# Altium project Gesturelink Backplane.PrjPcb
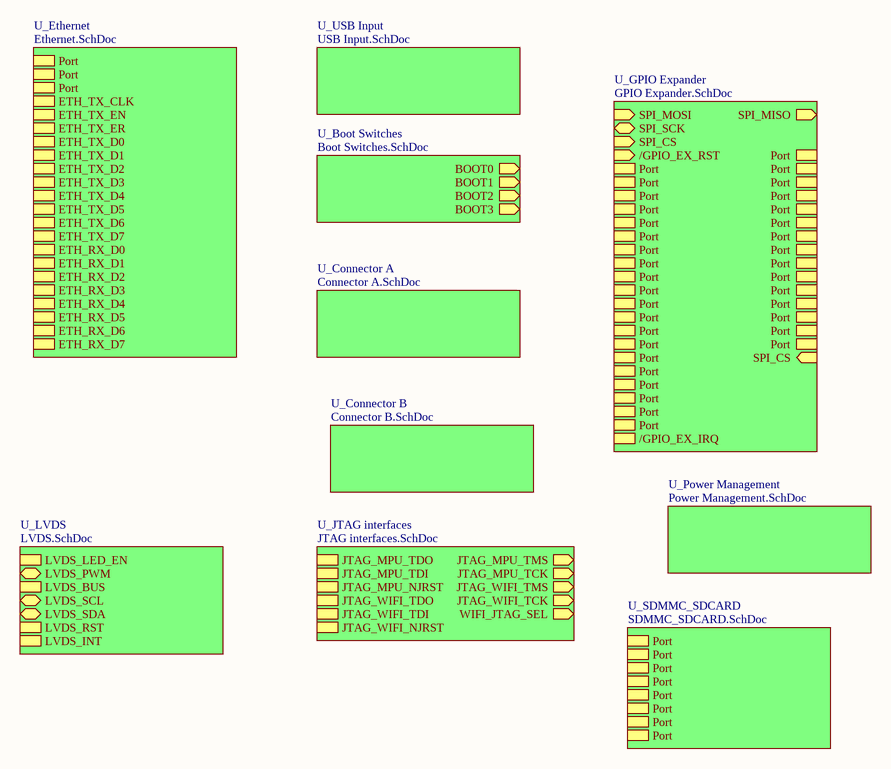
[diagram p0: Main.SchDoc]
13 sheets, 226 parts. Net scope: hierarchical (ports join the sheet entries above them; power ports are global).
Board file: Backplane.PcbDoc
Sheets:
  Main.SchDoc
    U_USB Input = USB Input.SchDoc
    U_Boot Switches = Boot Switches.SchDoc
    U_Connector A = Connector A.SchDoc
    U_Connector B = Connector B.SchDoc
    U_Ethernet = Ethernet.SchDoc
    U_GPIO Expander = GPIO Expander.SchDoc
    U_JTAG interfaces = JTAG interfaces.SchDoc
    U_LVDS = LVDS.SchDoc
    U_Power Management = Power Management.SchDoc
    U_SDMMC_SDCARD = SDMMC_SDCARD.SchDoc
  PCIe.SchDoc
  Notes.SchDoc

## Sheet Main.SchDoc
size A4; SheetNumber: 1; SheetTotal: 12

### Sub-sheets
U_Boot Switches = Boot Switches.SchDoc: BOOT0 (out), BOOT1 (out), BOOT2 (out), BOOT3 (out)
U_Connector A = Connector A.SchDoc: no entries
U_Connector B = Connector B.SchDoc: no entries
U_Ethernet = Ethernet.SchDoc: Port, Port, Port, ETH_TX_CLK, ETH_TX_EN, ETH_TX_ER, ETH_TX_D0, ETH_TX_D1, ETH_TX_D2, ETH_TX_D3, ETH_TX_D4, ETH_TX_D5, ETH_TX_D6, ETH_TX_D7, ETH_RX_D0, ETH_RX_D1, ETH_RX_D2, ETH_RX_D3, ETH_RX_D4, ETH_RX_D5, ETH_RX_D6, ETH_RX_D7
U_GPIO Expander = GPIO Expander.SchDoc: SPI_MOSI (in), SPI_MISO (out), SPI_SCK (bidir), SPI_CS (in), /GPIO_EX_RST (in), Port, Port, Port, Port, Port, Port, Port, Port, Port, Port, Port, Port, Port, Port, Port, Port, Port, Port, Port, Port, /GPIO_EX_IRQ, Port, Port, Port, Port, Port, Port, Port, Port, Port, Port, Port, Port, Port, Port, Port, SPI_CS (in)
U_JTAG interfaces = JTAG interfaces.SchDoc: JTAG_MPU_TMS (out), JTAG_MPU_TCK (out), JTAG_MPU_TDO, JTAG_MPU_TDI, JTAG_MPU_NJRST, JTAG_WIFI_TMS (out), JTAG_WIFI_TCK (out), JTAG_WIFI_TDO, JTAG_WIFI_TDI, JTAG_WIFI_NJRST, WIFI_JTAG_SEL (out)
U_LVDS = LVDS.SchDoc: LVDS_LED_EN, LVDS_PWM (bidir), LVDS_BUS (harness LVDS_CONNECTOR), LVDS_SCL (bidir), LVDS_SDA (bidir), LVDS_RST, LVDS_INT
U_Power Management = Power Management.SchDoc: no entries
U_SDMMC_SDCARD = SDMMC_SDCARD.SchDoc: Port, Port, Port, Port, Port, Port, Port, Port
U_USB Input = USB Input.SchDoc: no entries

### Nets
NetR?#17_2: sheet U_Ethernet/Port, sheet U_Ethernet/Port, sheet U_Ethernet/Port
NetR?#44_2: sheet U_GPIO Expander/Port, sheet U_GPIO Expander/Port, sheet U_GPIO Expander/Port, sheet U_GPIO Expander/Port, sheet U_GPIO Expander/Port, sheet U_GPIO Expander/Port, sheet U_GPIO Expander/Port, sheet U_GPIO Expander/Port, sheet U_GPIO Expander/Port, sheet U_GPIO Expander/Port, sheet U_GPIO Expander/Port, sheet U_GPIO Expander/Port, sheet U_GPIO Expander/Port, sheet U_GPIO Expander/Port, sheet U_GPIO Expander/Port, sheet U_GPIO Expander/Port, sheet U_GPIO Expander/Port, sheet U_GPIO Expander/Port, sheet U_GPIO Expander/Port, sheet U_GPIO Expander/Port, sheet U_GPIO Expander/Port, sheet U_GPIO Expander/Port, sheet U_GPIO Expander/Port, sheet U_GPIO Expander/Port, sheet U_GPIO Expander/Port, sheet U_GPIO Expander/Port, sheet U_GPIO Expander/Port, sheet U_GPIO Expander/Port, sheet U_GPIO Expander/Port, sheet U_GPIO Expander/Port, sheet U_GPIO Expander/Port, sheet U_GPIO Expander/Port, sheet U_GPIO Expander/Port, sheet U_GPIO Expander/Port, sheet U_GPIO Expander/Port
NetR?#52_1: sheet U_GPIO Expander/SPI_CS, sheet U_GPIO Expander/SPI_CS
NetR?#131_1: sheet U_SDMMC_SDCARD/Port, sheet U_SDMMC_SDCARD/Port, sheet U_SDMMC_SDCARD/Port, sheet U_SDMMC_SDCARD/Port, sheet U_SDMMC_SDCARD/Port, sheet U_SDMMC_SDCARD/Port, sheet U_SDMMC_SDCARD/Port, sheet U_SDMMC_SDCARD/Port

## Sheet USB Input.SchDoc
size A4; SheetNumber: 4; SheetTotal: 13
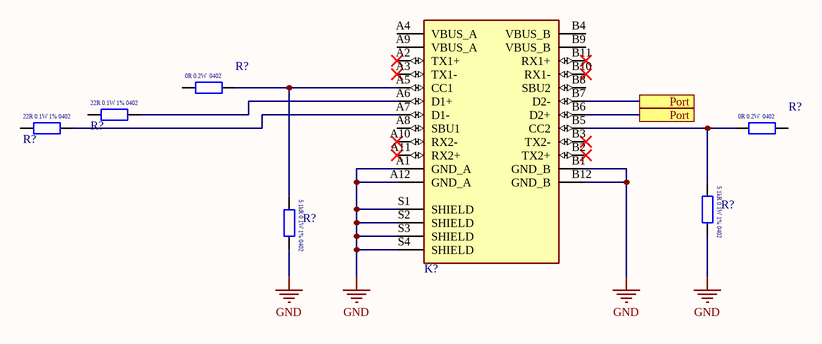
[diagram p1: USB Input.SchDoc]

### Parts
(Parts that share a designator on the sheet are numbered #1, #2 ... from top to bottom, then left to right.)
K?#1  2171830001  [217183-0001]  (value not drawn)
R?#1  CRCW04020000Z0EDHP  [RESC1005X04L]  (value not drawn)
R?#2  RK73H1ETTP22R0F  [RESC1005X04N]  (value not drawn)
R?#3  RK73H1ETTP22R0F  [RESC1005X04N]  (value not drawn)
R?#4  CRCW04020000Z0EDHP  [RESC1005X04L]  (value not drawn)
R?#5  RK73H1ETTP5101F  [RESC1005X04N]  (value not drawn)
R?#6  RK73H1ETTP5101F  [RESC1005X04N]  (value not drawn)

### Ports
Port

### Nets
GND: K?#1.A1(GND_A) K?#1.A12(GND_A) K?#1.B1(GND_B) K?#1.B12(GND_B) K?#1.S1(SHIELD) K?#1.S2(SHIELD) K?#1.S3(SHIELD) K?#1.S4(SHIELD) R?#5.2 R?#6.2
NetK?#1_A5: K?#1.A5(CC1) R?#1.2 R?#6.1
NetK?#1_A6: K?#1.A6(D1+) R?#2.2
NetK?#1_A7: K?#1.A7(D1-) R?#3.2
NetK?#1_B5: K?#1.B5(CC2) R?#4.1 R?#5.1
NetK?#1_B6: K?#1.B6(D2+) K?#1.B7(D2-) ; port Port

Not connected (* = marked no-connect by the designer): K?#1 A2(TX1+)* A3(TX1-)* A4(VBUS_A) A8(SBU1) A9(VBUS_A) A10(RX2-)* A11(RX2+)* B2(TX2+)* B3(TX2-)* B4(VBUS_B) B8(SBU2) B9(VBUS_B) B10(RX1-)* B11(RX1+)*; R?#1 1; R?#2 1; R?#3 1; R?#4 2

### Notes on the sheet
- (in symbol CRCW04020000Z0EDHP) 0R 0.2W  0402
- (in symbol RK73H1ETTP22R0F) 22R 0.1W 1% 0402
- (in symbol RK73H1ETTP5101F) 5.1kR 0.1W 1% 0402

### Library data of the parts
K?#1 = 2171830001: USB-C (USB TYPE-C) USB 3.2 Gen 1 (USB 3.1 Gen 1, Superspeed (USB 3.0)) Receptacle Connector 24 Position Through Hole, Right Angle
R?#1 R?#4 = CRCW04020000Z0EDHP: 0 Ohms Jumper Chip Resistor 0402 (1005 Metric) Automotive AEC-Q200, Pulse Withstanding Thick Film; ComponentLink1Description: New link; ComponentLink1URL: https://www.digikey.com.au/en/products/detail/vishay-dale/CRCW04020000Z0EDHP/2222496; Supplier 1: Mouser; Supplier Part Number 1: 71-CRCW04020000Z0EDH
R?#2 R?#3 = RK73H1ETTP22R0F: 22 Ohms ±1% 0.1W, 1/10W Chip Resistor 0402 (1005 Metric) Automotive AEC-Q200 Thick Film
R?#5 R?#6 = RK73H1ETTP5101F: 5.1 kOhms ±1% 0.1W, 1/10W Chip Resistor 0402 (1005 Metric) Automotive AEC-Q200 Thick Film

## Sheet Boot Switches.SchDoc
size A4; SheetNumber: 9; SheetTotal: 10
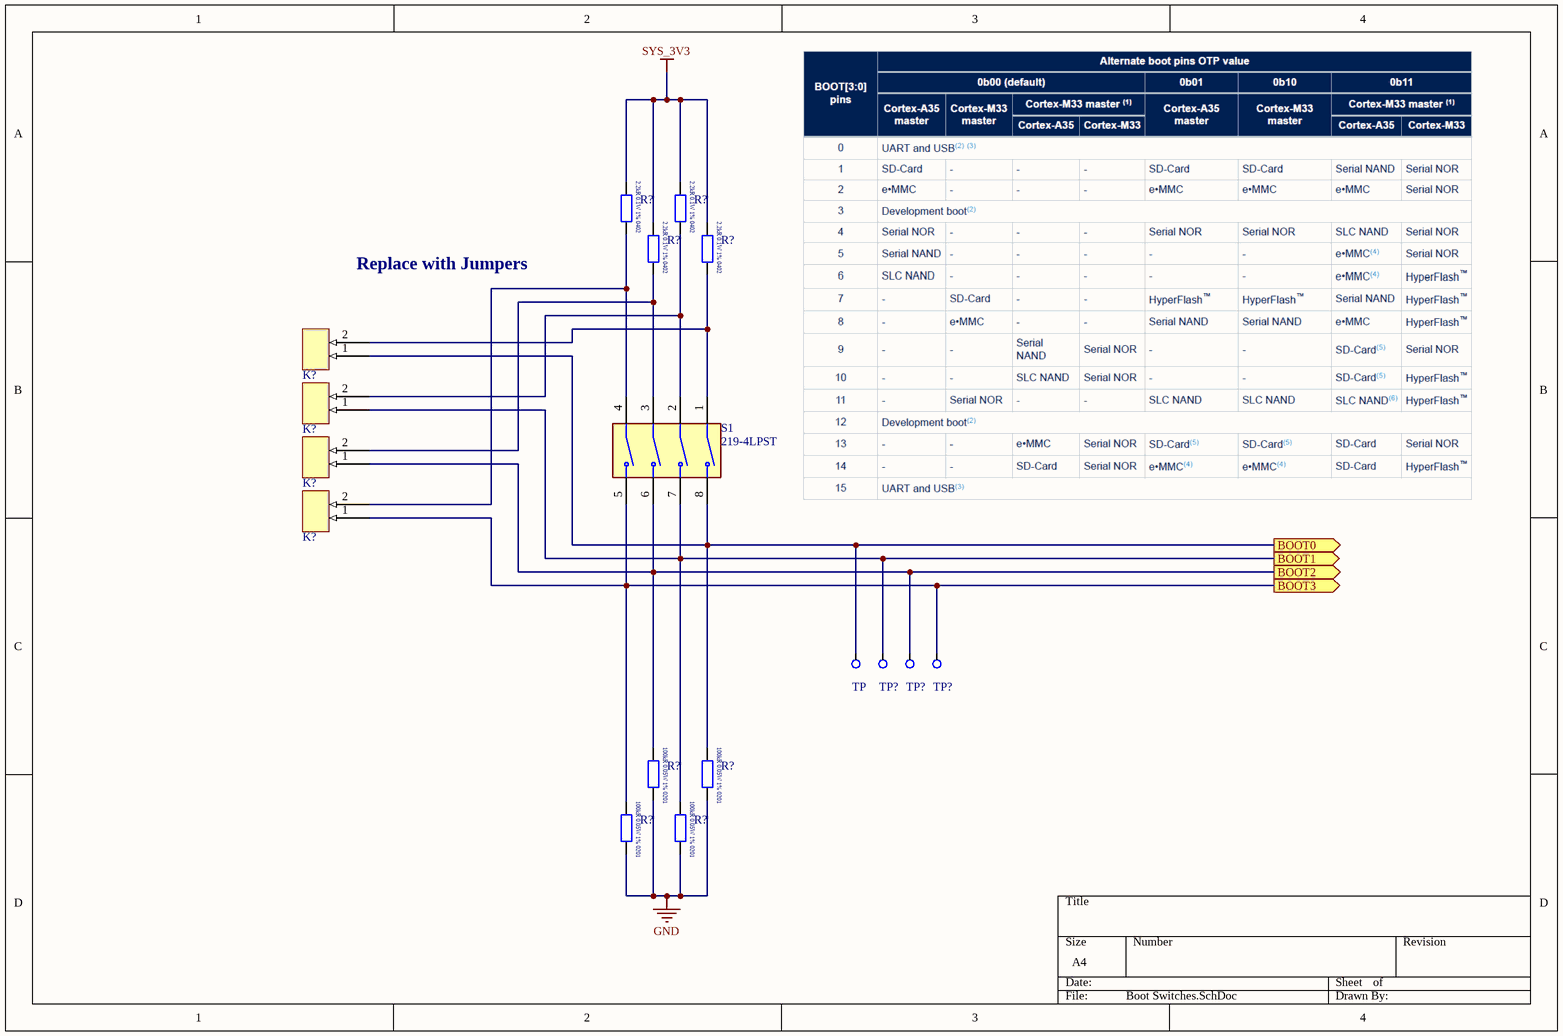
[diagram p2: Boot Switches.SchDoc]

### Parts
(Parts that share a designator on the sheet are numbered #1, #2 ... from top to bottom, then left to right.)
K?#2  TSW-102-07-F-S  [SAMTEC_TSW-102-07-F-S]  (value not drawn)
K?#3  TSW-102-07-F-S  [SAMTEC_TSW-102-07-F-S]  (value not drawn)
K?#4  TSW-102-07-F-S  [SAMTEC_TSW-102-07-F-S]  (value not drawn)
K?#5  TSW-102-07-F-S  [SAMTEC_TSW-102-07-F-S]  (value not drawn)
R?#7  ERJ-2RKF2201X  [RESC1005X04N]  (value not drawn)
R?#8  ERJ-2RKF2201X  [RESC1005X04N]  (value not drawn)
R?#9  ERJ-2RKF2201X  [RESC1005X04N]  (value not drawn)
R?#10  ERJ-2RKF2201X  [RESC1005X04N]  (value not drawn)
R?#11  RK73H1ETTP1003F  [RESC1005X04N]  (value not drawn)
R?#12  RK73H1ETTP1003F  [RESC1005X04N]  (value not drawn)
R?#13  RK73H1ETTP1003F  [RESC1005X04N]  (value not drawn)
R?#14  RK73H1ETTP1003F  [RESC1005X04N]  (value not drawn)
S1  219-4LPST  [SW_219-4LPST]
TP#1  Test Point  [Test Point]  (value not drawn)
TP?#1  Test Point  [Test Point]  (value not drawn)
TP?#2  Test Point  [Test Point]  (value not drawn)
TP?#3  Test Point  [Test Point]  (value not drawn)

### Ports
BOOT0 (out), BOOT1 (out), BOOT2 (out), BOOT3 (out)

### Nets
GND: R?#11.2 R?#12.2 R?#13.2 R?#14.2
SYS_3V3: R?#7.1 R?#8.1 R?#9.1 R?#10.1
NetK?#2_1: K?#2.1 R?#12.1 S1.8 TP#1.12 ; port BOOT0
NetK?#2_2: K?#2.2 R?#10.2 S1.1
NetK?#3_1: K?#3.1 R?#14.1 S1.7 TP?#1.12 ; port BOOT1
NetK?#3_2: K?#3.2 R?#8.2 S1.2
NetK?#4_1: K?#4.1 R?#11.1 S1.6 TP?#2.12 ; port BOOT2
NetK?#4_2: K?#4.2 R?#9.2 S1.3
NetK?#5_1: K?#5.1 R?#13.1 S1.5 TP?#3.12 ; port BOOT3
NetK?#5_2: K?#5.2 R?#7.2 S1.4

### Notes on the sheet
- Replace with Jumpers
- (in symbol ERJ-2RKF2201X) 2.2kR 0.1W 1% 0402
- (in symbol RK73H1ETTP1003F) 100kR 0.05W 1% 0201

### Library data of the parts
K?#2-K?#5 = TSW-102-07-F-S: Connector Header Through Hole 2 position 0.100" (2.54mm)
R?#7-R?#10 = ERJ-2RKF2201X: RES SMD 2.2K OHM 1% 1/10W 0402
R?#11-R?#14 = RK73H1ETTP1003F: 100 kOhms ±1% 0.1W, 1/10W Chip Resistor 0402 (1005 Metric) Automotive AEC-Q200 Thick Film
S1 = 219-4LPST: Dip Switch SPST 4 Position Surface Mount Slide (Standard) Actuator 100mA 20VDC; MF: {'manufacturer': u'CTS Electrocomponents'}; Package: None; Price: None; Value: *; MP: 219-4LPST; Availability: Unavailable

## Sheet Connector A.SchDoc
size A4; SheetNumber: 2; SheetTotal: 11
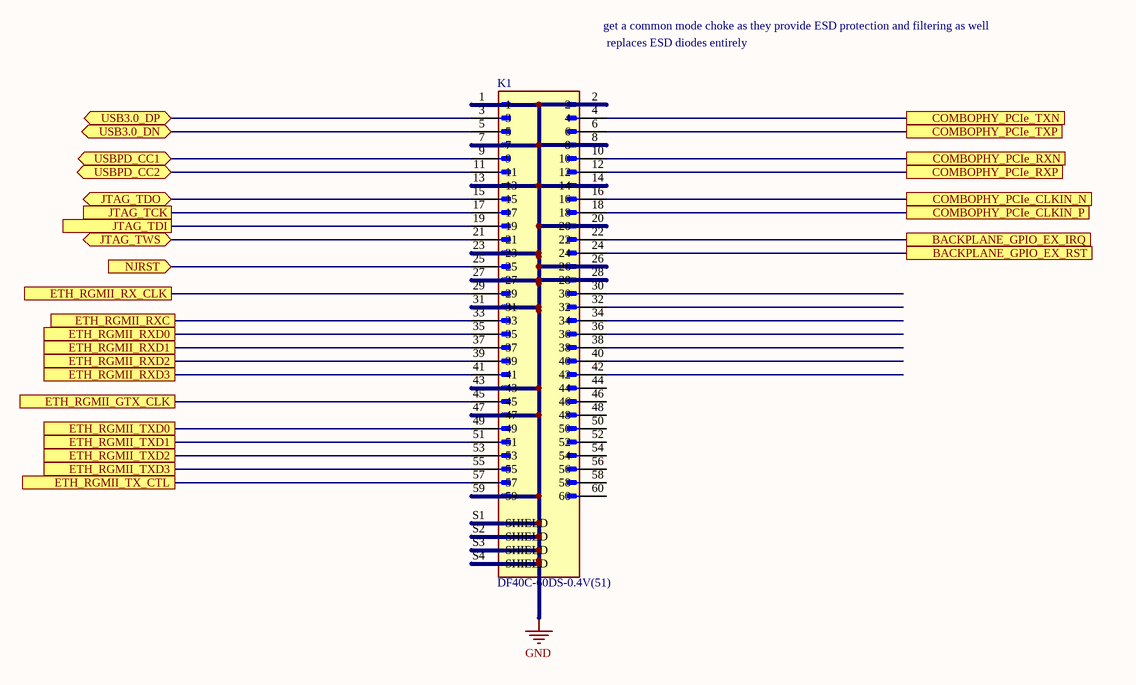
[diagram p3: Connector A.SchDoc]

### Parts
K1  DF40C-60DS-0.4V(51)  [DF40C-60DS-0.4V(51)]

### Ports
BACKPLANE_GPIO_EX_IRQ, BACKPLANE_GPIO_EX_RST, COMBOPHY_PCIe_CLKIN_N, COMBOPHY_PCIe_CLKIN_P, COMBOPHY_PCIe_RXN, COMBOPHY_PCIe_RXP, COMBOPHY_PCIe_TXN, COMBOPHY_PCIe_TXP, ETH_RGMII_GTX_CLK, ETH_RGMII_RX_CLK, ETH_RGMII_RXC, ETH_RGMII_RXD0, ETH_RGMII_RXD1, ETH_RGMII_RXD2, ETH_RGMII_RXD3, ETH_RGMII_TX_CTL, ETH_RGMII_TXD0, ETH_RGMII_TXD1, ETH_RGMII_TXD2, ETH_RGMII_TXD3, JTAG_TCK, JTAG_TDI, JTAG_TDO (bidir), JTAG_TWS (bidir), NJRST (in), USB3.0_DN (bidir), USB3.0_DP (bidir), USBPD_CC1 (bidir), USBPD_CC2 (bidir)

### Nets
GND: K1.1 K1.2 K1.7 K1.8 K1.13 K1.14 K1.20 K1.23 K1.26 K1.27 K1.28 K1.31 K1.43 K1.47 K1.59 K1.S1(SHIELD) K1.S2(SHIELD) K1.S3(SHIELD) K1.S4(SHIELD)
NetK1_3: K1.3 ; port USB3.0_DP
NetK1_4: K1.4 ; port COMBOPHY_PCIe_TXN
NetK1_5: K1.5 ; port USB3.0_DN
NetK1_6: K1.6 ; port COMBOPHY_PCIe_TXP
NetK1_9: K1.9 ; port USBPD_CC1
NetK1_10: K1.10 ; port COMBOPHY_PCIe_RXN
NetK1_11: K1.11 ; port USBPD_CC2
NetK1_12: K1.12 ; port COMBOPHY_PCIe_RXP
NetK1_15: K1.15 ; port JTAG_TDO
NetK1_16: K1.16 ; port COMBOPHY_PCIe_CLKIN_N
NetK1_17: K1.17 ; port JTAG_TCK
NetK1_18: K1.18 ; port COMBOPHY_PCIe_CLKIN_P
NetK1_19: K1.19 ; port JTAG_TDI
NetK1_21: K1.21 ; port JTAG_TWS
NetK1_22: K1.22 ; port BACKPLANE_GPIO_EX_IRQ
NetK1_24: K1.24 ; port BACKPLANE_GPIO_EX_RST
NetK1_25: K1.25 ; port NJRST
NetK1_29: K1.29 ; port ETH_RGMII_RX_CLK
NetK1_33: K1.33 ; port ETH_RGMII_RXC
NetK1_35: K1.35 ; port ETH_RGMII_RXD0
NetK1_37: K1.37 ; port ETH_RGMII_RXD1
NetK1_39: K1.39 ; port ETH_RGMII_RXD2
NetK1_41: K1.41 ; port ETH_RGMII_RXD3
NetK1_45: K1.45 ; port ETH_RGMII_GTX_CLK
NetK1_49: K1.49 ; port ETH_RGMII_TXD0
NetK1_51: K1.51 ; port ETH_RGMII_TXD1
NetK1_53: K1.53 ; port ETH_RGMII_TXD2
NetK1_55: K1.55 ; port ETH_RGMII_TXD3
NetK1_57: K1.57 ; port ETH_RGMII_TX_CTL

Not connected (* = marked no-connect by the designer): K1 30 32 34 36 38 40 42 44 46 48 50 52 54 56 58 60

### Notes on the sheet
- get a common mode choke as they provide ESD protection and filtering as well
- replaces ESD diodes entirely

### Library data of the parts
K1 = DF40C-60DS-0.4V(51): 60 Position Connector Receptacle, Center Strip Contacts Surface Mount Gold

## Sheet Connector B.SchDoc
size A4; SheetNumber: 2; SheetTotal: 9
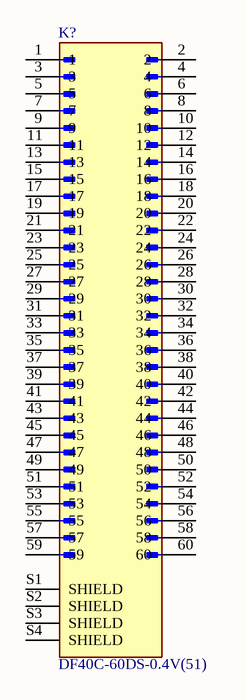
[diagram p4: Connector B.SchDoc]

### Parts
(Parts that share a designator on the sheet are numbered #1, #2 ... from top to bottom, then left to right.)
K?#6  DF40C-60DS-0.4V(51)  [DF40C-60DS-0.4V(51)]

### Nets

Not connected (* = marked no-connect by the designer): K?#6 1 2 3 4 5 6 7 8 9 10 11 12 13 14 15 16 17 18 19 20 21 22 23 24 25 26 27 28 29 30 31 32 33 34 35 36 37 38 39 40 41 42 43 44 45 46 47 48 49 50 51 52 53 54 55 56 57 58 59 60 S1(SHIELD) S2(SHIELD) S3(SHIELD) S4(SHIELD)

### Library data of the parts
K?#6 = DF40C-60DS-0.4V(51): 60 Position Connector Receptacle, Center Strip Contacts Surface Mount Gold /

## Sheet Ethernet.SchDoc
size A4; SheetNumber: 7; SheetTotal: 11
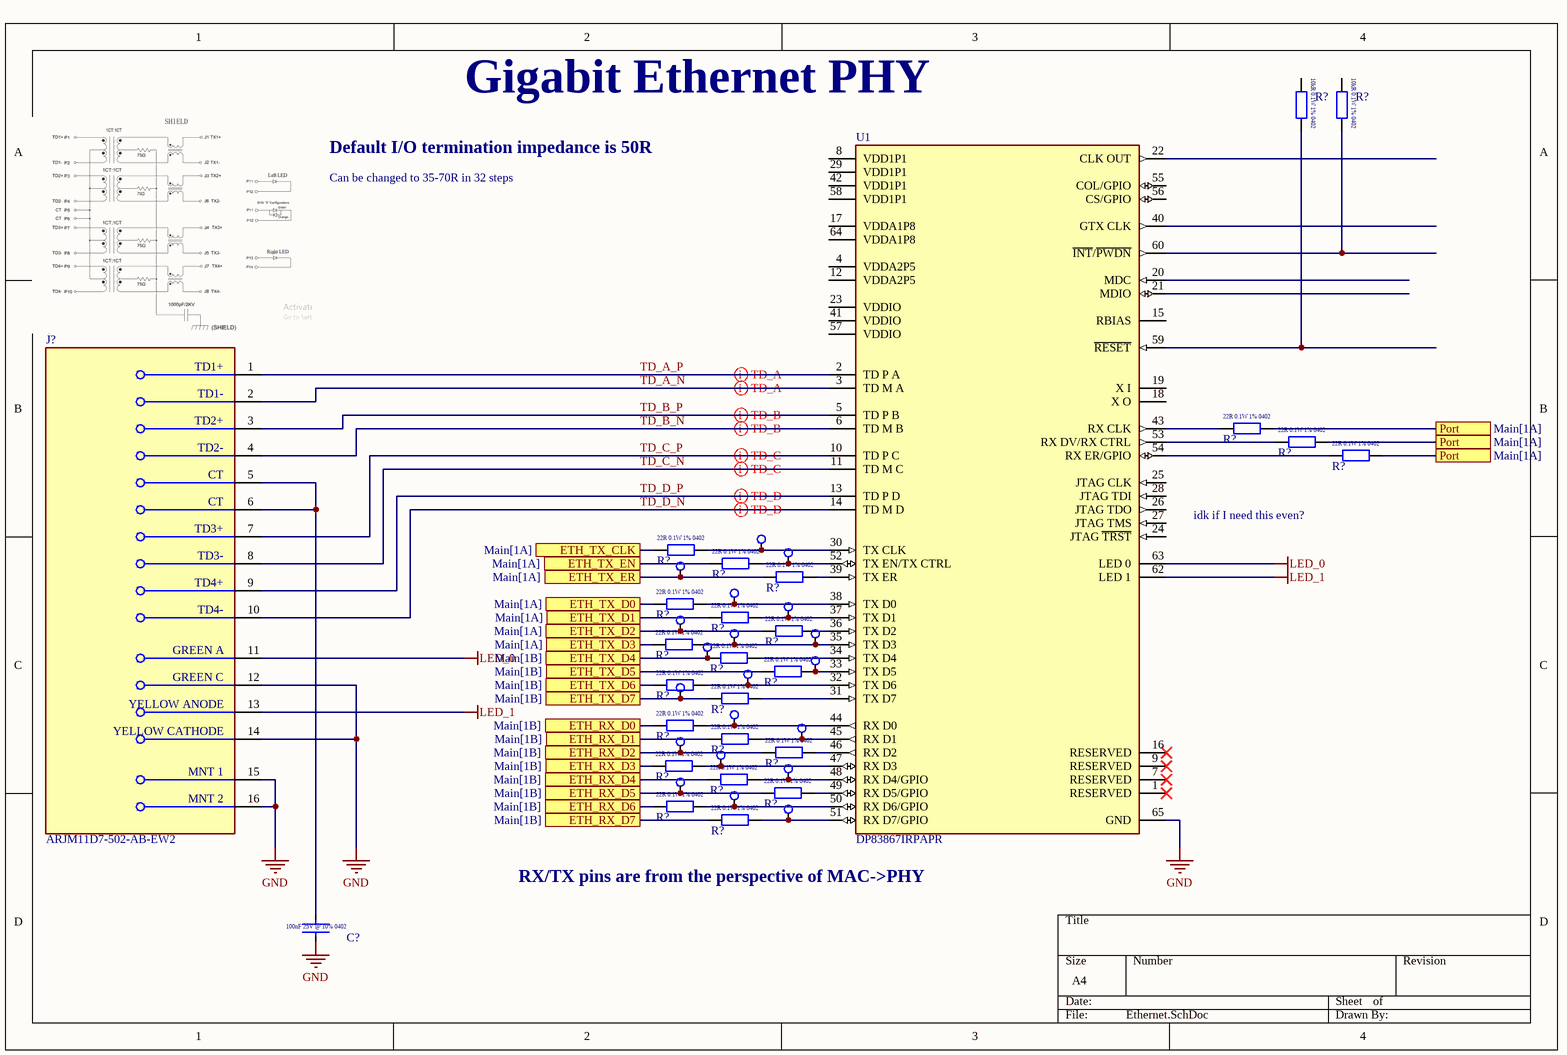
[diagram p5: Ethernet.SchDoc]

### Parts
(Parts that share a designator on the sheet are numbered #1, #2 ... from top to bottom, then left to right.)
C?#1  CL05A104KA5NNNC  [CAPC1005X06N]  (value not drawn)
J?#1  ARJM11D7-502-AB-EW2  [FP-ARJM11D7-502-AB-EW2-MFG]
R?#15  RK73H1ETTP1002F  [RESC1005X04N]  (value not drawn)
R?#16  RK73H1ETTP1002F  [RESC1005X04N]  (value not drawn)
R?#17  RK73H1ETTP22R0F  [RESC1005X04N]  (value not drawn)
R?#18  RK73H1ETTP22R0F  [RESC1005X04N]  (value not drawn)
R?#19  RK73H1ETTP22R0F  [RESC1005X04N]  (value not drawn)
R?#20  RK73H1ETTP22R0F  [RESC1005X04N]  (value not drawn)
R?#21  RK73H1ETTP22R0F  [RESC1005X04N]  (value not drawn)
R?#22  RK73H1ETTP22R0F  [RESC1005X04N]  (value not drawn)
R?#23  RK73H1ETTP22R0F  [RESC1005X04N]  (value not drawn)
R?#24  RK73H1ETTP22R0F  [RESC1005X04N]  (value not drawn)
R?#25  RK73H1ETTP22R0F  [RESC1005X04N]  (value not drawn)
R?#26  RK73H1ETTP22R0F  [RESC1005X04N]  (value not drawn)
R?#27  RK73H1ETTP22R0F  [RESC1005X04N]  (value not drawn)
R?#28  RK73H1ETTP22R0F  [RESC1005X04N]  (value not drawn)
R?#29  RK73H1ETTP22R0F  [RESC1005X04N]  (value not drawn)
R?#30  RK73H1ETTP22R0F  [RESC1005X04N]  (value not drawn)
R?#31  RK73H1ETTP22R0F  [RESC1005X04N]  (value not drawn)
R?#32  RK73H1ETTP22R0F  [RESC1005X04N]  (value not drawn)
R?#33  RK73H1ETTP22R0F  [RESC1005X04N]  (value not drawn)
R?#34  RK73H1ETTP22R0F  [RESC1005X04N]  (value not drawn)
R?#35  RK73H1ETTP22R0F  [RESC1005X04N]  (value not drawn)
R?#36  RK73H1ETTP22R0F  [RESC1005X04N]  (value not drawn)
R?#37  RK73H1ETTP22R0F  [RESC1005X04N]  (value not drawn)
R?#38  RK73H1ETTP22R0F  [RESC1005X04N]  (value not drawn)
TP1  Test Point  [Test Point]  (value not drawn)
TP2  Test Point  [Test Point]  (value not drawn)
TP3  Test Point  [Test Point]  (value not drawn)
TP4  Test Point  [Test Point]  (value not drawn)
TP5#1  Test Point  [Test Point]  (value not drawn)
TP5#2  Test Point  [Test Point]  (value not drawn)
TP7  Test Point  [Test Point]  (value not drawn)
TP8  Test Point  [Test Point]  (value not drawn)
TP9  Test Point  [Test Point]  (value not drawn)
TP10  Test Point  [Test Point]  (value not drawn)
TP11  Test Point  [Test Point]  (value not drawn)
TP?#4  Test Point  [Test Point]  (value not drawn)
TP?#5  Test Point  [Test Point]  (value not drawn)
TP?#6  Test Point  [Test Point]  (value not drawn)
TP?#7  Test Point  [Test Point]  (value not drawn)
TP?#8  Test Point  [Test Point]  (value not drawn)
TP?#9  Test Point  [Test Point]  (value not drawn)
TP?#10  Test Point  [Test Point]  (value not drawn)
TP?#11  Test Point  [Test Point]  (value not drawn)
TP?#12  Test Point  [Test Point]  (value not drawn)
U1  DP83867IRPAPR  [FP-PAP0064M-MFG]

### Ports
ETH_RX_D0 (see Main[1B]), ETH_RX_D1 (see Main[1B]), ETH_RX_D2 (see Main[1B]), ETH_RX_D3 (see Main[1B]), ETH_RX_D4 (see Main[1B]), ETH_RX_D5 (see Main[1B]), ETH_RX_D6 (see Main[1B]), ETH_RX_D7 (see Main[1B]), ETH_TX_CLK (see Main[1A]), ETH_TX_D0 (see Main[1A]), ETH_TX_D1 (see Main[1A]), ETH_TX_D2 (see Main[1A]), ETH_TX_D3 (see Main[1A]), ETH_TX_D4 (see Main[1B]), ETH_TX_D5 (see Main[1B]), ETH_TX_D6 (see Main[1B]), ETH_TX_D7 (see Main[1B]), ETH_TX_EN (see Main[1A]), ETH_TX_ER (see Main[1A]), Port (see Main[1A])

### Nets
GND: C?#1.1 J?#1.12(GREEN_C) J?#1.14(YELLOW_CATHODE) J?#1.15(MNT_1) J?#1.16(MNT_2) U1.65(GND)
LED_0: J?#1.11(GREEN_A) U1.63(LED_0)
LED_1: J?#1.13(YELLOW_ANODE) U1.62(LED_1)
TD_A_N: J?#1.2(TD1-) U1.3(TD_M_A)
TD_A_P: J?#1.1(TD1+) U1.2(TD_P_A)
TD_B_N: J?#1.4(TD2-) U1.6(TD_M_B)
TD_B_P: J?#1.3(TD2+) U1.5(TD_P_B)
TD_C_N: J?#1.8(TD3-) U1.11(TD_M_C)
TD_C_P: J?#1.7(TD3+) U1.10(TD_P_C)
TD_D_N: J?#1.10(TD4-) U1.14(TD_M_D)
TD_D_P: J?#1.9(TD4+) U1.13(TD_P_D)
NetC?#1_2: C?#1.2 J?#1.5(CT) J?#1.6(CT)
NetR?#15_2: R?#15.2 U1.59(~{RESET})
NetR?#16_2: R?#16.2 U1.60(~{INT}/~{PWDN})
NetR?#17_1: R?#17.1 U1.43(RX_CLK)
NetR?#17_2: R?#17.2 R?#18.2 R?#19.2 ; port Port
NetR?#18_1: R?#18.1 U1.53(RX_DV/RX_CTRL)
NetR?#19_1: R?#19.1 U1.54(RX_ER/GPIO)
NetR?#20_1: R?#20.1 ; port ETH_TX_CLK
NetR?#20_2: R?#20.2 TP1.12 U1.30(TX_CLK)
NetR?#21_1: R?#21.1 ; port ETH_TX_EN
NetR?#21_2: R?#21.2 TP2.12 U1.52(TX_EN/TX_CTRL)
NetR?#22_1: R?#22.1 TP3.12 ; port ETH_TX_ER
NetR?#22_2: R?#22.2 U1.39(TX_ER)
NetR?#23_1: R?#23.1 ; port ETH_TX_D0
NetR?#23_2: R?#23.2 TP4.12 U1.38(TX_D0)
NetR?#24_1: R?#24.1 ; port ETH_TX_D1
NetR?#24_2: R?#24.2 TP5#1.12 U1.37(TX_D1)
NetR?#25_1: R?#25.1 TP5#2.12 ; port ETH_TX_D2
NetR?#25_2: R?#25.2 U1.36(TX_D2)
NetR?#26_1: R?#26.1 ; port ETH_TX_D3
NetR?#26_2: R?#26.2 TP7.12 TP?#4.12 U1.35(TX_D3)
NetR?#27_1: R?#27.1 TP8.12 ; port ETH_TX_D4
NetR?#27_2: R?#27.2 U1.34(TX_D4)
NetR?#28_1: R?#28.1 ; port ETH_TX_D5
NetR?#28_2: R?#28.2 TP9.12 U1.33(TX_D5)
NetR?#29_1: R?#29.1 ; port ETH_TX_D6
NetR?#29_2: R?#29.2 TP10.12 U1.32(TX_D6)
NetR?#30_1: R?#30.1 TP11.12 ; port ETH_TX_D7
NetR?#30_2: R?#30.2 U1.31(TX_D7)
NetR?#31_1: R?#31.1 ; port ETH_RX_D0
NetR?#31_2: R?#31.2 TP?#5.12 U1.44(RX_D0)
NetR?#32_1: R?#32.1 ; port ETH_RX_D1
NetR?#32_2: R?#32.2 TP?#6.12 U1.45(RX_D1)
NetR?#33_1: R?#33.1 TP?#7.12 ; port ETH_RX_D2
NetR?#33_2: R?#33.2 U1.46(RX_D2)
NetR?#34_1: R?#34.1 ; port ETH_RX_D3
NetR?#34_2: R?#34.2 TP?#8.12 U1.47(RX_D3)
NetR?#35_1: R?#35.1 ; port ETH_RX_D4
NetR?#35_2: R?#35.2 TP?#9.12 U1.48(RX_D4/GPIO)
NetR?#36_1: R?#36.1 TP?#10.12 ; port ETH_RX_D5
NetR?#36_2: R?#36.2 U1.49(RX_D5/GPIO)
NetR?#37_1: R?#37.1 ; port ETH_RX_D6
NetR?#37_2: R?#37.2 TP?#11.12 U1.50(RX_D6/GPIO)
NetR?#38_1: R?#38.1 ; port ETH_RX_D7
NetR?#38_2: R?#38.2 TP?#12.12 U1.51(RX_D7/GPIO)

Not connected (* = marked no-connect by the designer): R?#15 1; R?#16 1; U1 1(RESERVED)* 4(VDDA2P5) 7(RESERVED)* 8(VDD1P1) 9(RESERVED)* 12(VDDA2P5) 15(RBIAS) 16(RESERVED)* 17(VDDA1P8) 18(X_O) 19(X_I) 20(MDC) 21(MDIO) 22(CLK_OUT) 23(VDDIO) 24(JTAG_~{TRST}) 25(JTAG_CLK) 26(JTAG_TDO) 27(JTAG_TMS) 28(JTAG_TDI) 29(VDD1P1) 40(GTX_CLK) 41(VDDIO) 42(VDD1P1) 55(COL/GPIO) 56(CS/GPIO) 57(VDDIO) 58(VDD1P1) 64(VDDA1P8)

### Layout directives
differential pair: TD_A_N, TD_A_P, TD_B_N, TD_B_P, TD_C_N, TD_C_P, TD_D_N, TD_D_P

### Notes on the sheet
- Gigabit Ethernet PHY
- Default I/O termination impedance is 50R
- Can be changed to 35-70R in 32 steps
- idk if I need this even?
- RX/TX pins are from the perspective of MAC->PHY
- (in symbol CL05A104KA5NNNC) 100nF 25V @ 10% 0402
- (in symbol RK73H1ETTP22R0F) 22R 0.1W 1% 0402
- (in symbol RK73H1ETTP1002F) 10kR 0.1W 1% 0402

### Library data of the parts
C?#1 = CL05A104KA5NNNC: 0.1 µF ±10% 25V Ceramic Capacitor X5R 0402 (1005 Metric)
J?#1 = CMP-27893-000003-1: CONN JACK 1PORT 1000 BASE-T PCB; Number of Ports: 1; Connector Type: RJ45; Shielding: Shielded; Direction: Up; Number of Cores per Jack: 8; Max Operating Temperature: 85°C; Min Operating Temperature: -40°C; Contact Plating: Gold; RoHS Compliant: Yes; Termination: Solder; Mount: Through Hole; Color: Green; Number of Rows: 1; Packaging: Tray
R?#15 R?#16 = RK73H1ETTP1002F: 10 kOhms ±1% 0.1W, 1/10W Chip Resistor 0402 (1005 Metric) Automotive AEC-Q200 Thick Film
R?#17-R?#38 = RK73H1ETTP22R0F: as R?#2 on sheet USB Input
U1 = CMP-04874-000030-1: IC ETHERNET PHY 64HTQFP; Operating Supply Current: 157mA; Cable Length: 130m; Interface: Serial; Max Operating Temperature: 85°C; RoHS Compliant: Yes; Lead Free: Lead Free; Min Operating Temperature: -40°C; Packaging: Tape and Reel

## Sheet GPIO Expander.SchDoc
size A4; SheetNumber: 8; SheetTotal: 13
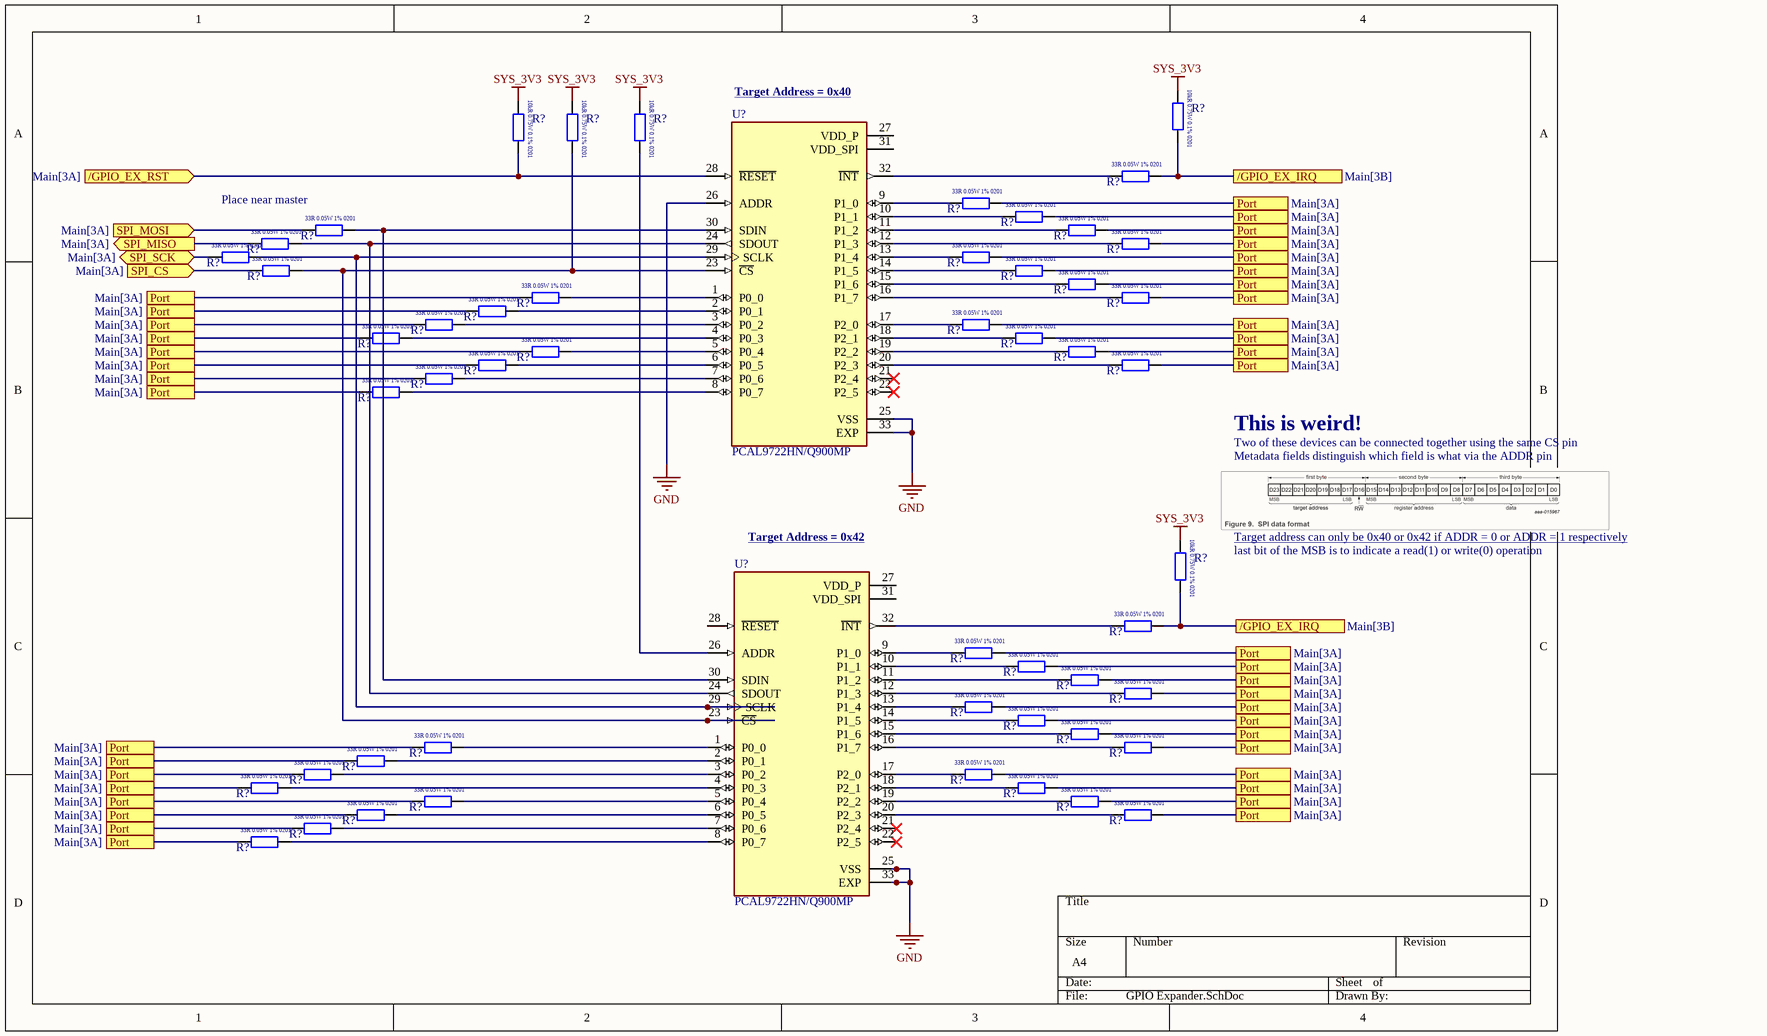
[diagram p6: GPIO Expander.SchDoc]

### Parts
(Parts that share a designator on the sheet are numbered #1, #2 ... from top to bottom, then left to right.)
R?#39  TNPW020110K0BEED  [RESC0603X03N]  (value not drawn)
R?#40  TNPW020110K0BEED  [RESC0603X03N]  (value not drawn)
R?#41  TNPW020110K0BEED  [RESC0603X03N]  (value not drawn)
R?#42  TNPW020110K0BEED  [RESC0603X03N]  (value not drawn)
R?#43  ERJ-1GNF33R0C  [RESC0603X03L]  (value not drawn)
R?#44  ERJ-1GNF33R0C  [RESC0603X03L]  (value not drawn)
R?#45  ERJ-1GNF33R0C  [RESC0603X03L]  (value not drawn)
R?#46  ERJ-1GNF33R0C  [RESC0603X03L]  (value not drawn)
R?#47  ERJ-1GNF33R0C  [RESC0603X03L]  (value not drawn)
R?#48  ERJ-1GNF33R0C  [RESC0603X03L]  (value not drawn)
R?#49  ERJ-1GNF33R0C  [RESC0603X03L]  (value not drawn)
R?#50  ERJ-1GNF33R0C  [RESC0603X03L]  (value not drawn)
R?#51  ERJ-1GNF33R0C  [RESC0603X03L]  (value not drawn)
R?#52  ERJ-1GNF33R0C  [RESC0603X03L]  (value not drawn)
R?#53  ERJ-1GNF33R0C  [RESC0603X03L]  (value not drawn)
R?#54  ERJ-1GNF33R0C  [RESC0603X03L]  (value not drawn)
R?#55  ERJ-1GNF33R0C  [RESC0603X03L]  (value not drawn)
R?#56  ERJ-1GNF33R0C  [RESC0603X03L]  (value not drawn)
R?#57  ERJ-1GNF33R0C  [RESC0603X03L]  (value not drawn)
R?#58  ERJ-1GNF33R0C  [RESC0603X03L]  (value not drawn)
R?#59  ERJ-1GNF33R0C  [RESC0603X03L]  (value not drawn)
R?#60  ERJ-1GNF33R0C  [RESC0603X03L]  (value not drawn)
R?#61  ERJ-1GNF33R0C  [RESC0603X03L]  (value not drawn)
R?#62  ERJ-1GNF33R0C  [RESC0603X03L]  (value not drawn)
R?#63  ERJ-1GNF33R0C  [RESC0603X03L]  (value not drawn)
R?#64  ERJ-1GNF33R0C  [RESC0603X03L]  (value not drawn)
R?#65  ERJ-1GNF33R0C  [RESC0603X03L]  (value not drawn)
R?#66  ERJ-1GNF33R0C  [RESC0603X03L]  (value not drawn)
R?#67  ERJ-1GNF33R0C  [RESC0603X03L]  (value not drawn)
R?#68  TNPW020110K0BEED  [RESC0603X03N]  (value not drawn)
R?#69  ERJ-1GNF33R0C  [RESC0603X03L]  (value not drawn)
R?#70  ERJ-1GNF33R0C  [RESC0603X03L]  (value not drawn)
R?#71  ERJ-1GNF33R0C  [RESC0603X03L]  (value not drawn)
R?#72  ERJ-1GNF33R0C  [RESC0603X03L]  (value not drawn)
R?#73  ERJ-1GNF33R0C  [RESC0603X03L]  (value not drawn)
R?#74  ERJ-1GNF33R0C  [RESC0603X03L]  (value not drawn)
R?#75  ERJ-1GNF33R0C  [RESC0603X03L]  (value not drawn)
R?#76  ERJ-1GNF33R0C  [RESC0603X03L]  (value not drawn)
R?#77  ERJ-1GNF33R0C  [RESC0603X03L]  (value not drawn)
R?#78  ERJ-1GNF33R0C  [RESC0603X03L]  (value not drawn)
R?#79  ERJ-1GNF33R0C  [RESC0603X03L]  (value not drawn)
R?#80  ERJ-1GNF33R0C  [RESC0603X03L]  (value not drawn)
R?#81  ERJ-1GNF33R0C  [RESC0603X03L]  (value not drawn)
R?#82  ERJ-1GNF33R0C  [RESC0603X03L]  (value not drawn)
R?#83  ERJ-1GNF33R0C  [RESC0603X03L]  (value not drawn)
R?#84  ERJ-1GNF33R0C  [RESC0603X03L]  (value not drawn)
R?#85  ERJ-1GNF33R0C  [RESC0603X03L]  (value not drawn)
R?#86  ERJ-1GNF33R0C  [RESC0603X03L]  (value not drawn)
R?#87  ERJ-1GNF33R0C  [RESC0603X03L]  (value not drawn)
R?#88  ERJ-1GNF33R0C  [RESC0603X03L]  (value not drawn)
R?#89  ERJ-1GNF33R0C  [RESC0603X03L]  (value not drawn)
U?#1  PCAL9722HN/Q900MP  [IC_PCAL9722HN/Q900MP]
U?#2  PCAL9722HN/Q900MP  [IC_PCAL9722HN/Q900MP]

### Ports
/GPIO_EX_IRQ (see Main[3B]), /GPIO_EX_RST (in, see Main[3A]), Port (see Main[3A]), SPI_CS (in, see Main[3A]), SPI_MISO (out, see Main[3A]), SPI_MOSI (in, see Main[3A]), SPI_SCK (bidir, see Main[3A])

### Nets
GND: U?#1.25(VSS) U?#1.26(ADDR) U?#1.33(EXP) U?#2.25(VSS) U?#2.33(EXP)
SYS_3V3: R?#39.1 R?#40.1 R?#41.1 R?#42.1 R?#68.1
NetR?#39_2: R?#39.2 R?#43.2 R?#68.2 R?#69.2 ; port /GPIO_EX_IRQ
NetR?#40_2: R?#40.2 U?#1.28(~{RESET}) ; port /GPIO_EX_RST
NetR?#41_2: R?#41.2 R?#52.2 U?#1.23(~{CS}) U?#2.23(~{CS})
NetR?#42_2: R?#42.2 U?#2.26(ADDR)
NetR?#43_1: R?#43.1 U?#1.32(~{INT})
NetR?#44_1: R?#44.1 U?#1.9(P1_0)
NetR?#44_2: R?#44.2 R?#45.2 R?#47.2 R?#49.2 R?#51.2 R?#53.2 R?#54.2 R?#55.1 R?#56.2 R?#57.1 R?#58.1 R?#59.2 R?#60.1 R?#61.2 R?#62.1 R?#63.2 R?#64.1 R?#65.2 R?#66.1 R?#67.1 R?#70.2 R?#71.2 R?#72.2 R?#73.2 R?#74.2 R?#75.2 R?#76.2 R?#77.1 R?#78.2 R?#79.1 R?#80.1 R?#81.2 R?#82.1 R?#83.2 R?#84.1 R?#85.2 R?#86.1 R?#87.2 R?#88.1 R?#89.1 ; port Port
NetR?#45_1: R?#45.1 U?#1.10(P1_1)
NetR?#46_1: R?#46.1 ; port SPI_MOSI
NetR?#46_2: R?#46.2 U?#1.30(SDIN) U?#2.30(SDIN)
NetR?#47_1: R?#47.1 U?#1.11(P1_2)
NetR?#48_1: R?#48.1 ; port SPI_MISO
NetR?#48_2: R?#48.2 U?#1.24(SDOUT) U?#2.24(SDOUT)
NetR?#49_1: R?#49.1 U?#1.12(P1_3)
NetR?#50_1: R?#50.1 ; port SPI_SCK
NetR?#50_2: R?#50.2 U?#1.29(SCLK) U?#2.29(SCLK)
NetR?#51_1: R?#51.1 U?#1.13(P1_4)
NetR?#52_1: R?#52.1 ; port SPI_CS
NetR?#53_1: R?#53.1 U?#1.14(P1_5)
NetR?#54_1: R?#54.1 U?#1.15(P1_6)
NetR?#55_2: R?#55.2 U?#1.1(P0_0)
NetR?#56_1: R?#56.1 U?#1.16(P1_7)
NetR?#57_2: R?#57.2 U?#1.2(P0_1)
NetR?#58_2: R?#58.2 U?#1.3(P0_2)
NetR?#59_1: R?#59.1 U?#1.17(P2_0)
NetR?#60_2: R?#60.2 U?#1.4(P0_3)
NetR?#61_1: R?#61.1 U?#1.18(P2_1)
NetR?#62_2: R?#62.2 U?#1.5(P0_4)
NetR?#63_1: R?#63.1 U?#1.19(P2_2)
NetR?#64_2: R?#64.2 U?#1.6(P0_5)
NetR?#65_1: R?#65.1 U?#1.20(P2_3)
NetR?#66_2: R?#66.2 U?#1.7(P0_6)
NetR?#67_2: R?#67.2 U?#1.8(P0_7)
NetR?#69_1: R?#69.1 U?#2.32(~{INT})
NetR?#70_1: R?#70.1 U?#2.9(P1_0)
NetR?#71_1: R?#71.1 U?#2.10(P1_1)
NetR?#72_1: R?#72.1 U?#2.11(P1_2)
NetR?#73_1: R?#73.1 U?#2.12(P1_3)
NetR?#74_1: R?#74.1 U?#2.13(P1_4)
NetR?#75_1: R?#75.1 U?#2.14(P1_5)
NetR?#76_1: R?#76.1 U?#2.15(P1_6)
NetR?#77_2: R?#77.2 U?#2.1(P0_0)
NetR?#78_1: R?#78.1 U?#2.16(P1_7)
NetR?#79_2: R?#79.2 U?#2.2(P0_1)
NetR?#80_2: R?#80.2 U?#2.3(P0_2)
NetR?#81_1: R?#81.1 U?#2.17(P2_0)
NetR?#82_2: R?#82.2 U?#2.4(P0_3)
NetR?#83_1: R?#83.1 U?#2.18(P2_1)
NetR?#84_2: R?#84.2 U?#2.5(P0_4)
NetR?#85_1: R?#85.1 U?#2.19(P2_2)
NetR?#86_2: R?#86.2 U?#2.6(P0_5)
NetR?#87_1: R?#87.1 U?#2.20(P2_3)
NetR?#88_2: R?#88.2 U?#2.7(P0_6)
NetR?#89_2: R?#89.2 U?#2.8(P0_7)

Not connected (* = marked no-connect by the designer): U?#1 21(P2_4)* 22(P2_5)* 27(VDD_P) 31(VDD_SPI); U?#2 21(P2_4)* 22(P2_5)* 27(VDD_P) 28(~{RESET}) 31(VDD_SPI)

### Notes on the sheet
- (near U?#1) Target Address = 0x40
- (near R?#46) Place near master
- This is weird!
- Two of these devices can be connected together using the same CS pin
- Metadata fields distinguish which field is what via the ADDR pin
- (near U?#2) Target Address = 0x42
- Target address can only be 0x40 or 0x42 if ADDR = 0 or ADDR = 1 respectively
- (near R?#68) last bit of the MSB is to indicate a read(1) or write(0) operation
- (in symbol ERJ-1GNF33R0C) 33R 0.05W 1% 0201
- (in symbol TNPW020110K0BEED) 10kR 0.75W 0.1% 0201

### Library data of the parts
R?#39-R?#42 R?#68 = TNPW020110K0BEED: 10 kOhms ±0.1% 0.075W Chip Resistor 0201 (0603 Metric) Anti-Sulfur, Automotive AEC-Q200, Moisture Resistant Thin Film
R?#43-R?#67 R?#69-R?#89 = ERJ-1GNF33R0C: 33 Ohms ±1% 0.05W, 1/20W Chip Resistor 0201 (0603 Metric) Thick Film; ComponentLink1Description: New link; ComponentLink1URL: https://www.digikey.com.au/en/products/detail/panasonic-electronic-components/ERJ-1GNF33R0C/2035941
U?#1 U?#2 = PCAL9722HN/Q900MP: MF: {'manufacturer': u'NXP Semiconductors'}; Package: None; Price: None; Value: *; MP: PCAL9722HN/Q900MP; Availability: Unavailable

## Sheet JTAG interfaces.SchDoc
size A4; SheetNumber: 10; SheetTotal: 10
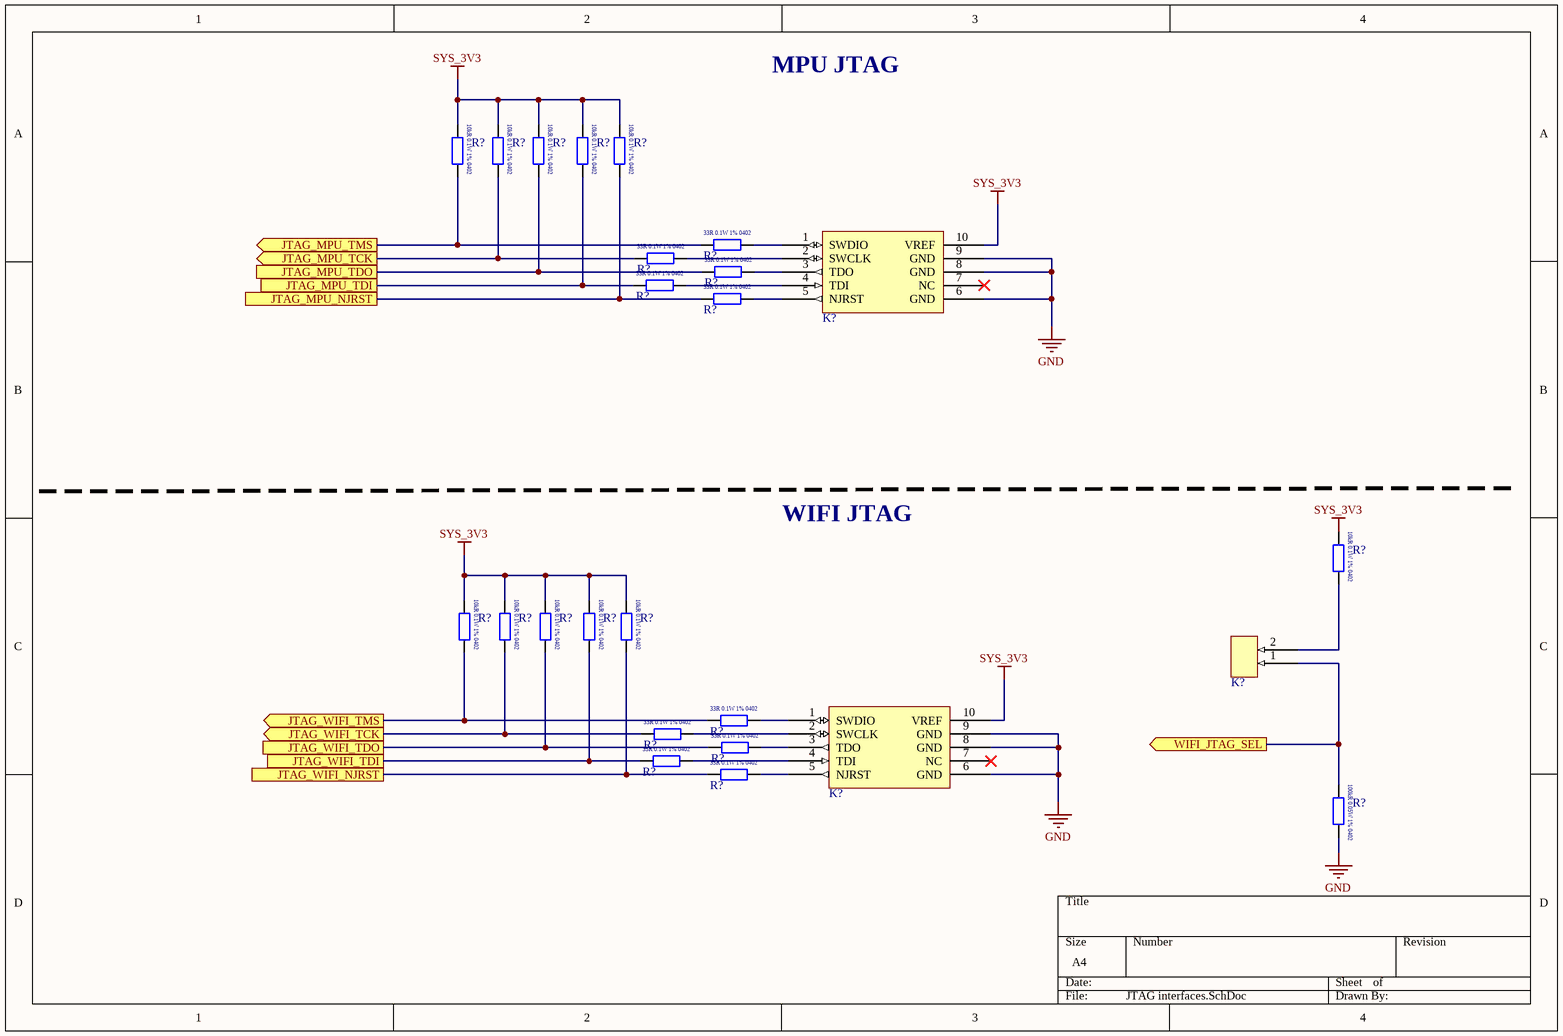
[diagram p7: JTAG interfaces.SchDoc]

### Parts
(Parts that share a designator on the sheet are numbered #1, #2 ... from top to bottom, then left to right.)
K?#7  20021521-00010T1LF  [AMPHENOL_20021521-00010T1LF]  (value not drawn)
K?#8  TSW-102-07-F-S  [SAMTEC_TSW-102-07-F-S]  (value not drawn)
K?#9  20021521-00010T1LF  [AMPHENOL_20021521-00010T1LF]  (value not drawn)
R?#90  RK73H1ETTP1002F  [RESC1005X04N]  (value not drawn)
R?#91  RK73H1ETTP1002F  [RESC1005X04N]  (value not drawn)
R?#92  RK73H1ETTP1002F  [RESC1005X04N]  (value not drawn)
R?#93  RK73H1ETTP1002F  [RESC1005X04N]  (value not drawn)
R?#94  RK73H1ETTP1002F  [RESC1005X04N]  (value not drawn)
R?#95  ERJ-2RKF33R0X  [RESC1005X04L]  (value not drawn)
R?#96  ERJ-2RKF33R0X  [RESC1005X04L]  (value not drawn)
R?#97  ERJ-2RKF33R0X  [RESC1005X04L]  (value not drawn)
R?#98  ERJ-2RKF33R0X  [RESC1005X04L]  (value not drawn)
R?#99  ERJ-2RKF33R0X  [RESC1005X04L]  (value not drawn)
R?#100  RK73H1ETTP1002F  [RESC1005X04N]  (value not drawn)
R?#101  RK73H1ETTP1002F  [RESC1005X04N]  (value not drawn)
R?#102  RK73H1ETTP1002F  [RESC1005X04N]  (value not drawn)
R?#103  RK73H1ETTP1002F  [RESC1005X04N]  (value not drawn)
R?#104  RK73H1ETTP1002F  [RESC1005X04N]  (value not drawn)
R?#105  RK73H1ETTP1002F  [RESC1005X04N]  (value not drawn)
R?#106  ERJ-2RKF33R0X  [RESC1005X04L]  (value not drawn)
R?#107  ERJ-2RKF33R0X  [RESC1005X04L]  (value not drawn)
R?#108  ERJ-2RKF33R0X  [RESC1005X04L]  (value not drawn)
R?#109  ERJ-2RKF33R0X  [RESC1005X04L]  (value not drawn)
R?#110  ERJ-2RKF33R0X  [RESC1005X04L]  (value not drawn)
R?#111  RK73H1ETTP1003F  [RESC1005X04N]  (value not drawn)

### Ports
JTAG_MPU_NJRST, JTAG_MPU_TCK (out), JTAG_MPU_TDI, JTAG_MPU_TDO, JTAG_MPU_TMS (out), JTAG_WIFI_NJRST, JTAG_WIFI_TCK (out), JTAG_WIFI_TDI, JTAG_WIFI_TDO, JTAG_WIFI_TMS (out), WIFI_JTAG_SEL (out)

### Nets
GND: K?#7.6(GND) K?#7.8(GND) K?#7.9(GND) K?#9.6(GND) K?#9.8(GND) K?#9.9(GND) R?#111.2
SYS_3V3: K?#7.10(VREF) K?#9.10(VREF) R?#90.1 R?#91.1 R?#92.1 R?#93.1 R?#94.1 R?#100.1 R?#101.1 R?#102.1 R?#103.1 R?#104.1 R?#105.1
NetK?#7_1: K?#7.1(SWDIO) R?#95.2
NetK?#7_2: K?#7.2(SWCLK) R?#96.2
NetK?#7_3: K?#7.3(TDO) R?#97.2
NetK?#7_4: K?#7.4(TDI) R?#98.2
NetK?#7_5: K?#7.5(NJRST) R?#99.2
NetK?#8_1: K?#8.1 R?#111.1 ; port WIFI_JTAG_SEL
NetK?#8_2: K?#8.2 R?#100.2
NetK?#9_1: K?#9.1(SWDIO) R?#106.2
NetK?#9_2: K?#9.2(SWCLK) R?#107.2
NetK?#9_3: K?#9.3(TDO) R?#108.2
NetK?#9_4: K?#9.4(TDI) R?#109.2
NetK?#9_5: K?#9.5(NJRST) R?#110.2
NetR?#90_2: R?#90.2 R?#95.1 ; port JTAG_MPU_TMS
NetR?#91_2: R?#91.2 R?#96.1 ; port JTAG_MPU_TCK
NetR?#92_2: R?#92.2 R?#97.1 ; port JTAG_MPU_TDO
NetR?#93_2: R?#93.2 R?#98.1 ; port JTAG_MPU_TDI
NetR?#94_2: R?#94.2 R?#99.1 ; port JTAG_MPU_NJRST
NetR?#101_2: R?#101.2 R?#106.1 ; port JTAG_WIFI_TMS
NetR?#102_2: R?#102.2 R?#107.1 ; port JTAG_WIFI_TCK
NetR?#103_2: R?#103.2 R?#108.1 ; port JTAG_WIFI_TDO
NetR?#104_2: R?#104.2 R?#109.1 ; port JTAG_WIFI_TDI
NetR?#105_2: R?#105.2 R?#110.1 ; port JTAG_WIFI_NJRST

Not connected (* = marked no-connect by the designer): K?#7 7(NC)*; K?#9 7(NC)*

### Notes on the sheet
- MPU JTAG
- WIFI JTAG
- (in symbol ERJ-2RKF33R0X) 33R 0.1W 1% 0402
- (in symbol RK73H1ETTP1002F) 10kR 0.1W 1% 0402
- (in symbol RK73H1ETTP1003F) 100kR 0.05W 1% 0402

### Library data of the parts
K?#7 K?#9 = 20021521-00010T1LF: Connector Header Surface Mount 10 position 0.050" (1.27mm)
K?#8 = TSW-102-07-F-S: as K?#2 on sheet Boot Switches
R?#90-R?#94 R?#100-R?#105 = RK73H1ETTP1002F: as R?#15 on sheet Ethernet
R?#95-R?#99 R?#106-R?#110 = ERJ-2RKF33R0X: 33 Ohms ±1% 0.1W, 1/10W Chip Resistor 0402 (1005 Metric) Automotive AEC-Q200 Thick Film
R?#111 = RK73H1ETTP1003F: as R?#11 on sheet Boot Switches

## Sheet LVDS.SchDoc
size 594 x 420 mm; SheetNumber: 9; SheetTotal: 13
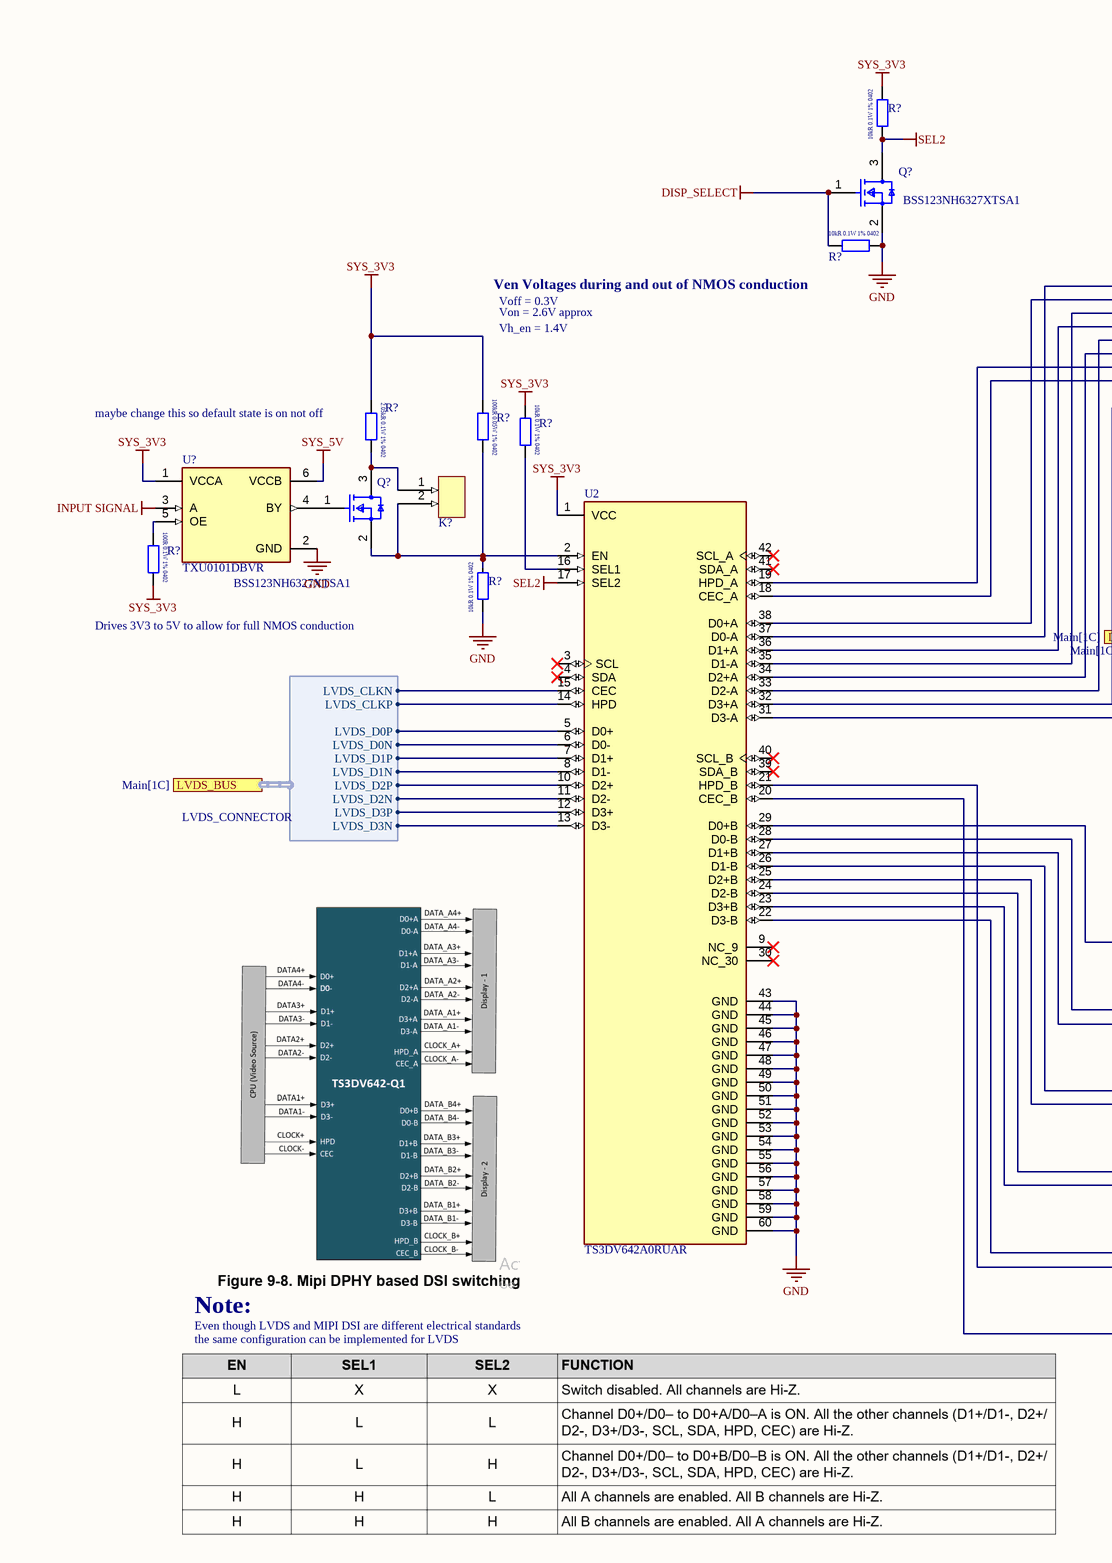
[diagram p8: LVDS.SchDoc, top left]
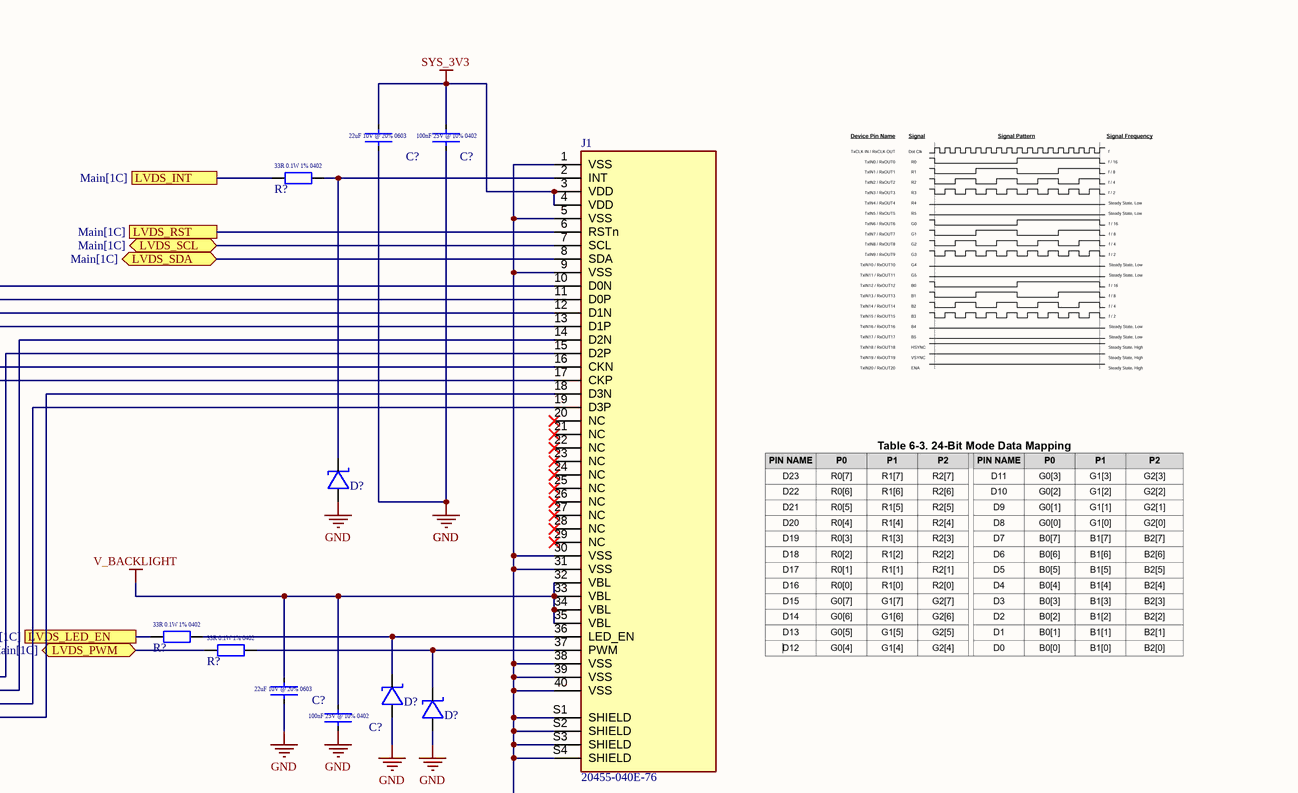
[diagram p9: LVDS.SchDoc, top right]
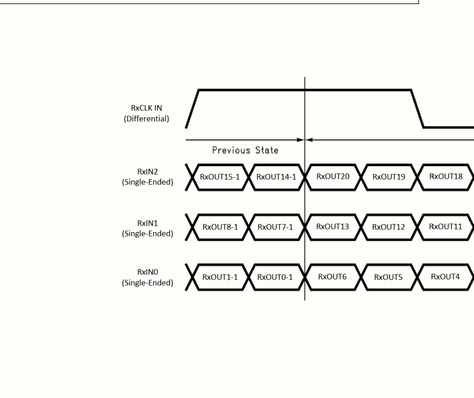
[diagram p10: LVDS.SchDoc, bottom left]
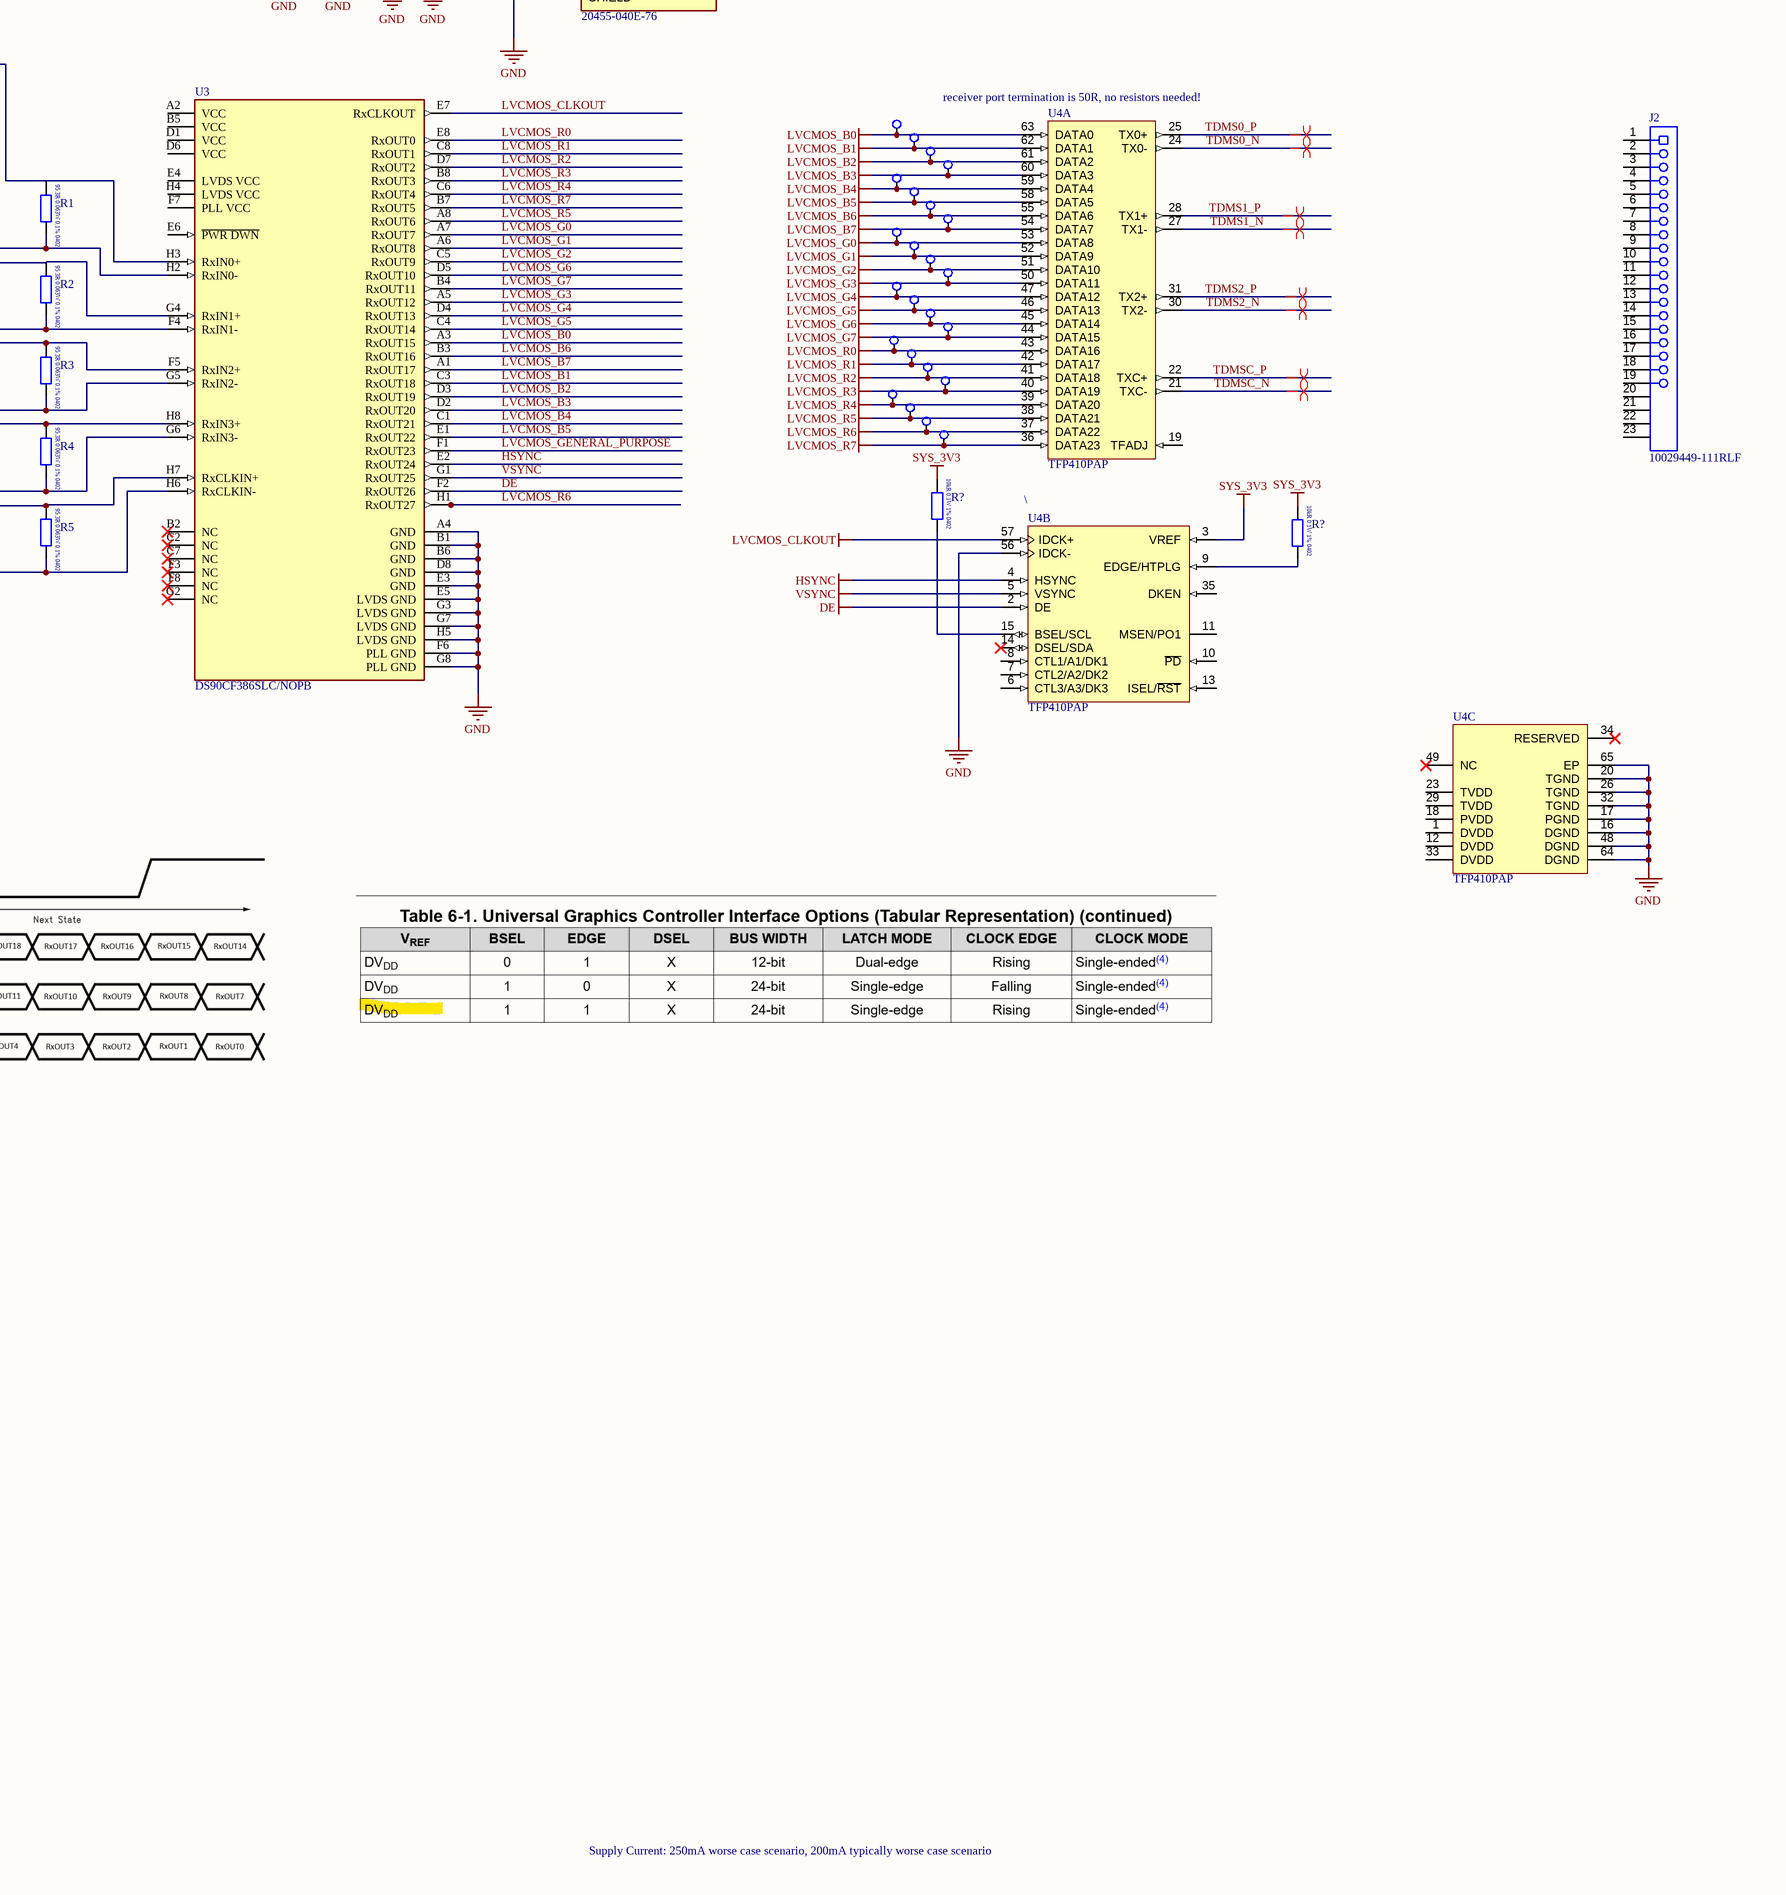
[diagram p11: LVDS.SchDoc, bottom right]

### Parts
(Parts that share a designator on the sheet are numbered #1, #2 ... from top to bottom, then left to right.)
C?#2  CL10A226MP8NUNE  [CAPC1608X09N]  (value not drawn)
C?#3  CL05A104KA5NNNC  [CAPC1005X06N]  (value not drawn)
C?#4  CL10A226MP8NUNE  [CAPC1608X09N]  (value not drawn)
C?#5  CL05A104KA5NNNC  [CAPC1005X06N]  (value not drawn)
D?#1  ESD5581N2T5G  [DIODFN100X60X40-2N]  (value not drawn)
D?#2  ESD5581N2T5G  [DIODFN100X60X40-2N]  (value not drawn)
D?#3  ESD5581N2T5G  [DIODFN100X60X40-2N]  (value not drawn)
J1  20455-040E-76  [IPEX_20455-040E-76]
J2  10029449-111RLF  [FCI-10029449-111RLF_V]
K?#10  TSW-102-07-F-S  [SAMTEC_TSW-102-07-F-S]  (value not drawn)
Q?#1  BSS123NH6327XTSA1  [FP-PG-SOT23-3-MFG]
Q?#2  BSS123NH6327XTSA1  [FP-PG-SOT23-3-MFG]
R1  ERA-2AEB95R3X  [RESC1005X04L]  (value not drawn)
R2  ERA-2AEB95R3X  [RESC1005X04L]  (value not drawn)
R3  ERA-2AEB95R3X  [RESC1005X04L]  (value not drawn)
R4  ERA-2AEB95R3X  [RESC1005X04L]  (value not drawn)
R5  ERA-2AEB95R3X  [RESC1005X04L]  (value not drawn)
R?#112  RK73H1ETTP1002F  [RESC1005X04N]  (value not drawn)
R?#113  ERJ-2RKF33R0X  [RESC1005X04L]  (value not drawn)
R?#114  RK73H1ETTP1002F  [RESC1005X04N]  (value not drawn)
R?#115  RK73H1ETTP2051F  [RESC1005X04N]  (value not drawn)
R?#116  RK73H1ETTP1003F  [RESC1005X04N]  (value not drawn)
R?#117  RK73H1ETTP1002F  [RESC1005X04N]  (value not drawn)
R?#118  ERJ-2RKF1000X  [RESC1005X04L]  (value not drawn)
R?#119  RK73H1ETTP1002F  [RESC1005X04N]  (value not drawn)
R?#120  ERJ-2RKF33R0X  [RESC1005X04L]  (value not drawn)
R?#121  ERJ-2RKF33R0X  [RESC1005X04L]  (value not drawn)
R?#122  RK73H1ETTP1002F  [RESC1005X04N]  (value not drawn)
R?#123  RK73H1ETTP1002F  [RESC1005X04N]  (value not drawn)
TP#2  Test Point  [Test Point]  (value not drawn)
TP?#13  Test Point  [Test Point]  (value not drawn)
TP?#14  Test Point  [Test Point]  (value not drawn)
TP?#15  Test Point  [Test Point]  (value not drawn)
TP?#16  Test Point  [Test Point]  (value not drawn)
TP?#17  Test Point  [Test Point]  (value not drawn)
TP?#18  Test Point  [Test Point]  (value not drawn)
TP?#19  Test Point  [Test Point]  (value not drawn)
TP?#20  Test Point  [Test Point]  (value not drawn)
TP?#21  Test Point  [Test Point]  (value not drawn)
TP?#22  Test Point  [Test Point]  (value not drawn)
TP?#23  Test Point  [Test Point]  (value not drawn)
TP?#24  Test Point  [Test Point]  (value not drawn)
TP?#25  Test Point  [Test Point]  (value not drawn)
TP?#26  Test Point  [Test Point]  (value not drawn)
TP?#27  Test Point  [Test Point]  (value not drawn)
TP?#28  Test Point  [Test Point]  (value not drawn)
TP?#29  Test Point  [Test Point]  (value not drawn)
TP?#30  Test Point  [Test Point]  (value not drawn)
TP?#31  Test Point  [Test Point]  (value not drawn)
TP?#32  Test Point  [Test Point]  (value not drawn)
TP?#33  Test Point  [Test Point]  (value not drawn)
TP?#34  Test Point  [Test Point]  (value not drawn)
TP?#35  Test Point  [Test Point]  (value not drawn)
U2  TS3DV642A0RUAR  [QFN50P900X350X80-43N]
U3  DS90CF386SLC/NOPB  [FP-NZC0064A-MFG]
U4  TFP410PAP  [PAP0064D_L]  (parts A,B,C of 3)
U?#3  TXU0101DBVR  [IC_TXU0101DBVR]

### Ports
LVDS_BUS (harness LVDS_CONNECTOR, see Main[1C]), LVDS_INT (see Main[1C]), LVDS_LED_EN (see Main[1C]), LVDS_PWM (bidir, see Main[1C]), LVDS_RST (see Main[1C]), LVDS_SCL (bidir, see Main[1C]), LVDS_SDA (bidir, see Main[1C])

### Harnesses
LVDS_CONNECTOR: LVDS_D0N, LVDS_D0P, LVDS_D1N, LVDS_D1P, LVDS_D2N, LVDS_D2P, LVDS_CLKN, LVDS_CLKP, LVDS_D3N, LVDS_D3P

### Nets
DE: U3.F2(RxOUT26) U4.2(DE)
DISP_SELECT: Q?#1.1(G) R?#114.1
GND: C?#2.1 C?#3.1 C?#4.1 C?#5.1 D?#1.1 D?#2.1 D?#3.1 J1.1(VSS) J1.5(VSS) J1.9(VSS) J1.30(VSS) J1.31(VSS) J1.38(VSS) J1.39(VSS) J1.40(VSS) J1.S1(SHIELD) J1.S2(SHIELD) J1.S3(SHIELD) J1.S4(SHIELD) Q?#1.2(S) R?#114.2 R?#119.1 U2.43(GND) U2.44(GND) U2.45(GND) U2.46(GND) U2.47(GND) U2.48(GND) U2.49(GND) U2.50(GND) U2.51(GND) U2.52(GND) U2.53(GND) U2.54(GND) U2.55(GND) U2.56(GND) U2.57(GND) U2.58(GND) U2.59(GND) U2.60(GND) U3.A4(GND) U3.B1(GND) U3.B6(GND) U3.D8(GND) U3.E3(GND) U3.E5(LVDS_GND) U3.F6(PLL_GND) U3.G3(LVDS_GND) U3.G7(LVDS_GND) U3.G8(PLL_GND) U3.H5(LVDS_GND) U4.16(DGND) U4.17(PGND) U4.20(TGND) U4.26(TGND) U4.32(TGND) U4.48(DGND) U4.56(IDCK-) U4.64(DGND) U4.65(EP) U?#3.2(GND)
HSYNC: U3.E2(RxOUT24) U4.4(HSYNC)
INPUT SIGNAL: U?#3.3(A)
LVCMOS_B0: TP#2.12 U3.A3(RxOUT15) U4.63(DATA0)
LVCMOS_B1: TP?#13.12 U3.C3(RxOUT18) U4.62(DATA1)
LVCMOS_B2: TP?#14.12 U3.D3(RxOUT19) U4.61(DATA2)
LVCMOS_B3: TP?#15.12 U3.D2(RxOUT20) U4.60(DATA3)
LVCMOS_B4: TP?#16.12 U3.C1(RxOUT21) U4.59(DATA4)
LVCMOS_B5: TP?#17.12 U3.E1(RxOUT22) U4.58(DATA5)
LVCMOS_B6: TP?#18.12 U3.B3(RxOUT16) U4.55(DATA6)
LVCMOS_B7: TP?#19.12 U3.A1(RxOUT17) U4.54(DATA7)
LVCMOS_CLKOUT: U3.E7(RxCLKOUT) U4.57(IDCK+)
LVCMOS_G0: TP?#20.12 U3.A7(RxOUT7) U4.53(DATA8)
LVCMOS_G1: TP?#21.12 U3.A6(RxOUT8) U4.52(DATA9)
LVCMOS_G2: TP?#22.12 U3.C5(RxOUT9) U4.51(DATA10)
LVCMOS_G3: TP?#23.12 U3.A5(RxOUT12) U4.50(DATA11)
LVCMOS_G4: TP?#24.12 U3.D4(RxOUT13) U4.47(DATA12)
LVCMOS_G5: TP?#25.12 U3.C4(RxOUT14) U4.46(DATA13)
LVCMOS_G6: TP?#26.12 U3.D5(RxOUT10) U4.45(DATA14)
LVCMOS_G7: TP?#27.12 U3.B4(RxOUT11) U4.44(DATA15)
LVCMOS_R0: TP?#28.12 U3.E8(RxOUT0) U4.43(DATA16)
LVCMOS_R1: TP?#29.12 U3.C8(RxOUT1) U4.42(DATA17)
LVCMOS_R2: TP?#30.12 U3.D7(RxOUT2) U4.41(DATA18)
LVCMOS_R3: TP?#31.12 U3.B8(RxOUT3) U4.40(DATA19)
LVCMOS_R4: TP?#32.12 U3.C6(RxOUT4) U4.39(DATA20)
LVCMOS_R5: TP?#33.12 U3.A8(RxOUT6) U4.38(DATA21)
LVCMOS_R6: TP?#34.12 U3.H1(RxOUT27) U4.37(DATA22)
LVCMOS_R7: TP?#35.12 U3.B7(RxOUT5) U4.36(DATA23)
SEL2: Q?#1.3(D) R?#112.1 U2.17(SEL2)
SYS_3V3: C?#2.2 C?#3.2 J1.3(VDD) J1.4(VDD) R?#112.2 R?#115.1 R?#116.1 R?#117.1 R?#118.2 R?#122.1 R?#123.1 U2.1(VCC) U4.3(VREF) U?#3.1(VCCA)
SYS_5V: U?#3.6(VCCB)
V_BACKLIGHT: C?#4.2 C?#5.2 J1.32(VBL) J1.33(VBL) J1.34(VBL) J1.35(VBL)
VSYNC: U3.G1(RxOUT25) U4.5(VSYNC)
LVCMOS_GENERAL_PURPOSE: U3.F1(RxOUT23)
TDMS0_N: U4.24(TX0-)
TDMS0_P: U4.25(TX0+)
TDMS1_N: U4.27(TX1-)
TDMS1_P: U4.28(TX1+)
TDMS2_N: U4.30(TX2-)
TDMS2_P: U4.31(TX2+)
TDMSC_N: U4.21(TXC-)
TDMSC_P: U4.22(TXC+)
NetD?#1_2: D?#1.2 J1.2(INT) R?#113.2
NetD?#2_2: D?#2.2 J1.36(LED_EN) R?#120.2
NetD?#3_2: D?#3.2 J1.37(PWM) R?#121.2
NetJ1_6: J1.6(RSTn) ; port LVDS_RST
NetJ1_7: J1.7(SCL) ; port LVDS_SCL
NetJ1_8: J1.8(SDA) ; port LVDS_SDA
NetJ1_10: J1.10(D0N) U2.37(D0-A)
NetJ1_11: J1.11(D0P) U2.38(D0+A)
NetJ1_12: J1.12(D1N) U2.35(D1-A)
NetJ1_13: J1.13(D1P) U2.36(D1+A)
NetJ1_14: J1.14(D2N) U2.33(D2-A)
NetJ1_15: J1.15(D2P) U2.34(D2+A)
NetJ1_16: J1.16(CKN) U2.19(HPD_A)
NetJ1_17: J1.17(CKP) U2.18(CEC_A)
NetJ1_18: J1.18(D3N) U2.31(D3-A)
NetJ1_19: J1.19(D3P) U2.32(D3+A)
NetK?#10_1: K?#10.1 Q?#2.3(D) R?#115.2
NetK?#10_2: K?#10.2 Q?#2.2(S) R?#116.2 R?#119.2 U2.2(EN)
NetQ?#2_1: Q?#2.1(G) U?#3.4(BY)
NetR1_2: R1.2 U2.28(D0-B) U3.H2(RxIN0-)
NetR2_1: R2.1 U2.27(D1+B)
NetR2_2: R2.2 U2.26(D1-B) U3.F4(RxIN1-)
NetR3_1: R3.1 U2.25(D2+B) U3.F5(RxIN2+)
NetR3_2: R3.2 U2.24(D2-B) U3.G5(RxIN2-)
NetR4_1: R4.1 U2.23(D3+B) U3.H8(RxIN3+)
NetR4_2: R4.2 U2.22(D3-B) U3.G6(RxIN3-)
NetR5_1: R5.1 U2.21(HPD_B) U3.H7(RxCLKIN+)
NetR5_2: R5.2 U2.20(CEC_B) U3.H6(RxCLKIN-)
NetR?#113_1: R?#113.1 ; port LVDS_INT
NetR?#117_2: R?#117.2 U2.16(SEL1)
NetR?#118_1: R?#118.1 U?#3.5(OE)
NetR?#120_1: R?#120.1 ; port LVDS_LED_EN
NetR?#121_1: R?#121.1 ; port LVDS_PWM
NetR?#122_2: R?#122.2 U4.15(BSEL/SCL)
NetR?#123_2: R?#123.2 U4.9(EDGE/HTPLG)
NetU2_5: U2.5(D0+) ; port LVDS_BUS.LVDS_D0P
NetU2_6: U2.6(D0-) ; port LVDS_BUS.LVDS_D0N
NetU2_7: U2.7(D1+) ; port LVDS_BUS.LVDS_D1P
NetU2_8: U2.8(D1-) ; port LVDS_BUS.LVDS_D1N
NetU2_10: U2.10(D2+) ; port LVDS_BUS.LVDS_D2P
NetU2_11: U2.11(D2-) ; port LVDS_BUS.LVDS_D2N
NetU2_12: U2.12(D3+) ; port LVDS_BUS.LVDS_D3P
NetU2_13: U2.13(D3-) ; port LVDS_BUS.LVDS_D3N
NetU2_14: U2.14(HPD) ; port LVDS_BUS.LVDS_CLKP
NetU2_15: U2.15(CEC) ; port LVDS_BUS.LVDS_CLKN
NetU2_29: U2.29(D0+B) U3.H3(RxIN0+)

Not connected (* = marked no-connect by the designer): J1 20(NC)* 21(NC)* 22(NC)* 23(NC)* 24(NC)* 25(NC)* 26(NC)* 27(NC)* 28(NC)* 29(NC)*; J2 1 2 3 4 5 6 7 8 9 10 11 12 13 14 15 16 17 18 19 20(SHLD1) 21(SHLD2) 22(SHLD3) 23(SHLD4); R1 1; U2 3(SCL)* 4(SDA)* 9(NC_9)* 30(NC_30)* 39(SDA_B)* 40(SCL_B)* 41(SDA_A)* 42(SCL_A)*; U3 A2(VCC) B2(NC)* B5(VCC) C2(NC)* C7(NC)* D1(VCC) D6(VCC) E4(LVDS_VCC) E6(~{PWR_DWN}) F3(NC)* F7(PLL_VCC) F8(NC)* G2(NC)* G4(RxIN1+) H4(LVDS_VCC); U4 1(DVDD) 6(CTL3/A3/DK3) 7(CTL2/A2/DK2) 8(CTL1/A1/DK1) 10(~{PD}) 11(MSEN/PO1) 12(DVDD) 13(ISEL/~{RST}) 14(DSEL/SDA)* 18(PVDD) 19(TFADJ) 23(TVDD) 29(TVDD) 33(DVDD) 34(RESERVED)* 35(DKEN) 49(NC)*

### Layout directives
differential pair: TDMS0_N, TDMS0_P, TDMS1_N, TDMS1_P, TDMS2_N, TDMS2_P, TDMSC_N, TDMSC_P

### Notes on the sheet
- (near R?#114) Ven Voltages during and out of NMOS conduction
- Vh_en = 1.4V
- Voff = 0.3V
- Von = 2.6V approx
- (near R?#115) maybe change this so default state is on not off
- Drives 3V3 to 5V to allow for full NMOS conduction
- receiver port termination is 50R, no resistors needed!
- (near U4) \
- Note:
- Even though LVDS and MIPI DSI are different electrical standards
- the same configuration can be implemented for LVDS
- Supply Current: 250mA worse case scenario, 200mA typically worse case scenario
- DWG NO:
- REV:
- THIS DOCUMENT AND THE DATA DISCLOSED HEREIN OR
- HEREWITH IS THE PROPERTY OF ALTIUM LIMITED AND MAY
- BE FREELY DISTRIBUTED IN WHOLE. NO RIGHTS ARE
- RESERVED OR EXPRESS OR IMPLIED WARANTEE GIVEN.
- REVISION
- DESCRIPTION
- DATE
- APPROVED
- ENG:
- APPROVALS
- PROJECT
- DSN:
- CHK:
- REFERENCE DOCUMENTS
- PROJECT REVISION:
- TITLE
- DOCUMENT REVISION:
- DESIGN ITEM:
- BOM:
- FAB DWG:
- PCB DWG:
- ASSY DWG:
- SCALE:
- A2
- SIZE
- CAGE CODE
- FILE NAME
- DWG NO.
- SHEET
- OF
- REV
- (in symbol CL05A104KA5NNNC) 100nF 25V @ 10% 0402
- (in symbol CL10A226MP8NUNE) 22uF 10V @ 20% 0603
- (in symbol ERA-2AEB95R3X) 95.3R 0.063W 0.1% 0402
- (in symbol ERJ-2RKF33R0X) 33R 0.1W 1% 0402
- (in symbol ERJ-2RKF1000X) 100R 0.1W 1% 0402
- (in symbol RK73H1ETTP1002F) 10kR 0.1W 1% 0402
- (in symbol RK73H1ETTP1003F) 100kR 0.05W 1% 0402
- (in symbol RK73H1ETTP2051F) 2.05kR 0.1W 1% 0402

### Library data of the parts
C?#2 C?#4 = CL10A226MP8NUNE: 22 µF ±20% 10V Ceramic Capacitor X5R 0603 (1608 Metric)
C?#3 C?#5 = CL05A104KA5NNNC: as C?#1 on sheet Ethernet
D?#1-D?#3 = ESD5581N2T5G: 12V Clamp 6A (8/20µs) Ipp Tvs Diode Surface Mount 2-X2DFN (1x0.6)
J1 = 20455-040E-76: N/A; Package: None; Price: None; Value: *; MP: 20455-040E-76; Availability: Unavailable
J2 = CMP-2000-05117-1: Surface Mount Type A HDMI Receptacle without Flange, 19 Positions, 0.5 mm Pitch, -55 to 85 degC, RoHS, Tape and Reel; Manufacturer: FCI; Gender: Female; Number of Positions / Contacts: 19; Contact Rating: 0.5A; Voltage Rating: 40V; Insulation Resistance: 100MOhms; RoHS: Details; Datasheet URL: https://datasheet.ciiva.com/851/10029449-851120.pdf; Termination Style: SMD; Contact Plating: Gold; Housing Material: Resin; Product Type: HDMI; Color: Black; Number of Positions: 19; Mounting Style: SMD/SMT; Packaging: Reel; Brand: FCI; Manufacturer URL: http://www.fci.com/; Contact Material: CopperAlloy; Orientation: Horizontal; Factory Pack Quantity: 400; Operating Temperature Range: -55Cto+85C; Product Category: HDMI,Displayport&DVIConnectors; Datasheet Version: Rev. S, 06/2012
K?#10 = TSW-102-07-F-S: as K?#2 on sheet Boot Switches
Q?#1 Q?#2 = CMP-32901-000006-1: MOSFET N-CH 100V 0.19A SOT-23; Manufacturer: Infineon; Rthja Max: 250K/W; Number Of Channels: 1; Typ Forward Diode Voltage: 0.8V; Drain To Source Resistance: 2.4Ω; Transconductance: 0.41S; Gate Charge At Vgs: 0.6nC @ 10V; Turn Off Delay Time: 7.4ns; Depletion Mode: False; Input Capacitace At Vds: 15.7pF @ 25V; Max Junction Temp: +150°C; Max Forward Diode Voltage: 1.1V; Power Dissipation: 0.5W; Gate To Source Voltage: 20V; Reverse Recovery Time: 12ns; Turn On Delay Time: 2.3ns; Reverse Recovery Charge: 4.3nC; Pulse Drain Current: 0.77A; Automotive Grade: Grade 0; Threshold Vgs Max: 1.8V; Octopart: https://octopart.com/bss123nh6327xtsa1-infineon-24621685; Category: Trans; Device Class L1: Discrete Semiconductors; Footprint Url: https://www.infineon.com/cms/en/product/packages/PG-SOT23/PG-SOT23-3-5/; Device Class L3: MOSFETs; Height: 1.1mm; ComponentLink2Description: Datasheet; Continuous Drain Current: 0.19A; Automotive: Yes; Device Class L2: Transistors; Lead Free: Yes; Threshold Vgs Min: 0.8V; Drain To Source Breakdown Voltage: 100V; Temperature Range Low: -55°C; Drain To Source Voltage: 100V; Digikey Description: MOSFET N-CH 100V 0.19A SOT-23; Manufacturer Part Number: BSS123NH6327XTSA1; Number Of N Channels: 1; ComponentLink2URL: https://www.infineon.com/dgdl/Infineon-BSS123N-DS-v02_03-en.pdf?fileId=db3a304335f1f4b6013639adfaaa1631; RoHS: TRUE; Mouser Description: Single N-Channel 100V 6 Ohm 0.6 nC OptiMOS? Small Signal Mosfet - SOT-23; Temperature Range High: +150°C; Package: PG-SOT23-3; Temperature: -55°C to +150°C
R1-R5 = ERA-2AEB95R3X: 95.3 Ohms ±0.1% 0.063W, 1/16W Chip Resistor 0402 (1005 Metric) Automotive AEC-Q200 Thin Film
R?#112 R?#114 R?#117 R?#119 R?#122 R?#123 = RK73H1ETTP1002F: as R?#15 on sheet Ethernet
R?#113 R?#120 R?#121 = ERJ-2RKF33R0X: as R?#95 on sheet JTAG interfaces
R?#115 = RK73H1ETTP2051F: 2.05 kOhms ±1% 0.1W, 1/10W Chip Resistor 0402 (1005 Metric) Automotive AEC-Q200 Thick Film; Supplier 1: DigiKey; Supplier Part Number 1: 2019-RK73H1ETTP2051FCT-ND
R?#116 = RK73H1ETTP1003F: as R?#11 on sheet Boot Switches
R?#118 = ERJ-2RKF1000X: 100 Ohms ±1% 0.1W, 1/10W Chip Resistor 0402 (1005 Metric) Automotive AEC-Q200 Thick Film; ComponentLink1Description: New link; ComponentLink1URL: https://www.digikey.com.au/en/products/detail/panasonic-electronic-components/ERJ-2RKF1000X/192080; Supplier 1: Mouser; Supplier Part Number 1: 667-ERJ-2RKF1000X
U2 = TS3DV642A0RUAR: Multi-Channel Differential Switch/Multiplexer Targeting DVI/HDMI & DisplayPort Applications 42-WQFN -40 to 85; MF: Texas Instruments; Texas_Instruments-Purchase-URL: https://snapeda.com/shop?store=Texas+Instruments&id=50654; SnapEDA_Link: https://www.snapeda.com/parts/TS3DV642A0RUAR/Texas%20Instruments/view-part/50654/?ref=snap; Price: None; Availability: Unavailable; Value: *; MP: TS3DV642A0RUAR; Package: WQFN-42 Texas Instruments; Check_prices: https://www.snapeda.com/parts/TS3DV642A0RUAR/Texas%20Instruments/view-part/50654/?ref=eda; Supplier 1: DigiKey; Supplier Part Number 1: 296-TS3DV642RUARQ1CT-ND
U3 = CMP-04872-000045-1: IC INTFACE SPECIALIZED 64NFBGA; Max Power Dissipation: 1.61W; Number of Elements: 3; Data Rate: 2380Mbps; Logic Function: Receiver; Number of Drivers: 28; Max Supply Voltage: 3.6V; Min Supply Voltage: 3V; Operating Supply Voltage: 3.3V; Power Dissipation: 1.61W; Series: DS90CF386; Min Operating Temperature: -10°C; Mount: Surface Mount; Case/Package: FBGA; Radiation Hardening: No; Lead Free: Lead Free; Packaging: Tray; Package Quantity: 360; Number of Receivers: 3; Number of Pins: 64; Max Operating Temperature: 70°C
U4 = CMP-0325-00079-3: PanelBus DVI Transmitter 165 MHz with 3 Data Channels, 3.3 V, 0 to +70 degC, 64-pin HTQFP (PAP), Green (RoHS & no Sb/Br); Manufacturer: Texas Instruments; Serial Data Transmitter Channels: 3; SubFamily: PanelBus (DVI); PLL Frequency(MHz): 25 to 165; Supply Voltage(s)(V): 3.3; Rating: Catalog; Transmitter: TRUE; Number of Parallel Inputs: 24; Eco-Plan: Green (RoHS & no Sb/Br); DatasheetVersion: SLDS145B; PackageDescription: 64-Pin Plastic Quad Flat Pack, 10 x 10 mm Body, 0.5 mm Pitch, Exposed Pad; PackageVersion: revC, Aug-2003; ComponentLink3Description: URL Link1; ComponentLink3URL: SamplesURL:http://www.ti.com/product/tfp410#samples; ComponentLink2Description: Datasheet; ComponentLink2URL: http://www.ti.com/general/docs/lit/getliterature.tsp?genericPartNumber=TFP410&fileType=pdf; ComponentLink1Description: Manufacturer URL; PackageReference: PAP0064D; Mounting Technology: Surface Mount; ComponentLink1URL: http://www.ti.com/; PartNumber: TFP410PAP
U?#3 = TXU0101DBVR: Voltage Level Translator Unidirectional 1 Circuit 1 Channel 200Mbps SOT-23-6; MF: Texas Instruments; SnapEDA_Link: https://www.snapeda.com/parts/TXU0101DBVR/Texas+Instruments/view-part/?ref=snap; Package: None; Value: *; MP: TXU0101DBVR; Check_prices: https://www.snapeda.com/parts/TXU0101DBVR/Texas+Instruments/view-part/?ref=eda

## Sheet Power Management.SchDoc
size A4; SheetNumber: 6; SheetTotal: 11
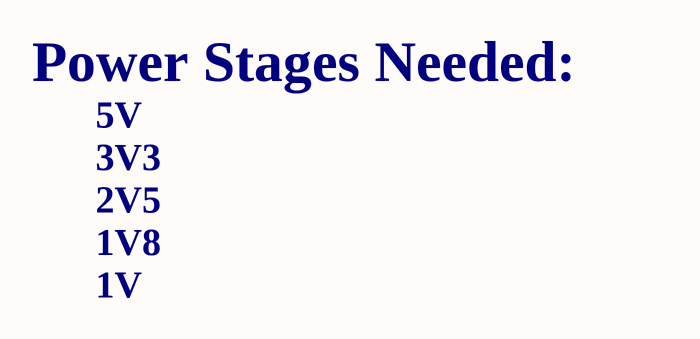
[diagram p12: Power Management.SchDoc]

### Notes on the sheet
- Power Stages Needed:
- 5V
- 3V3
- 2V5
- 1V8
- 1V

## Sheet SDMMC_SDCARD.SchDoc
size A4; SheetNumber: 3; SheetTotal: 9
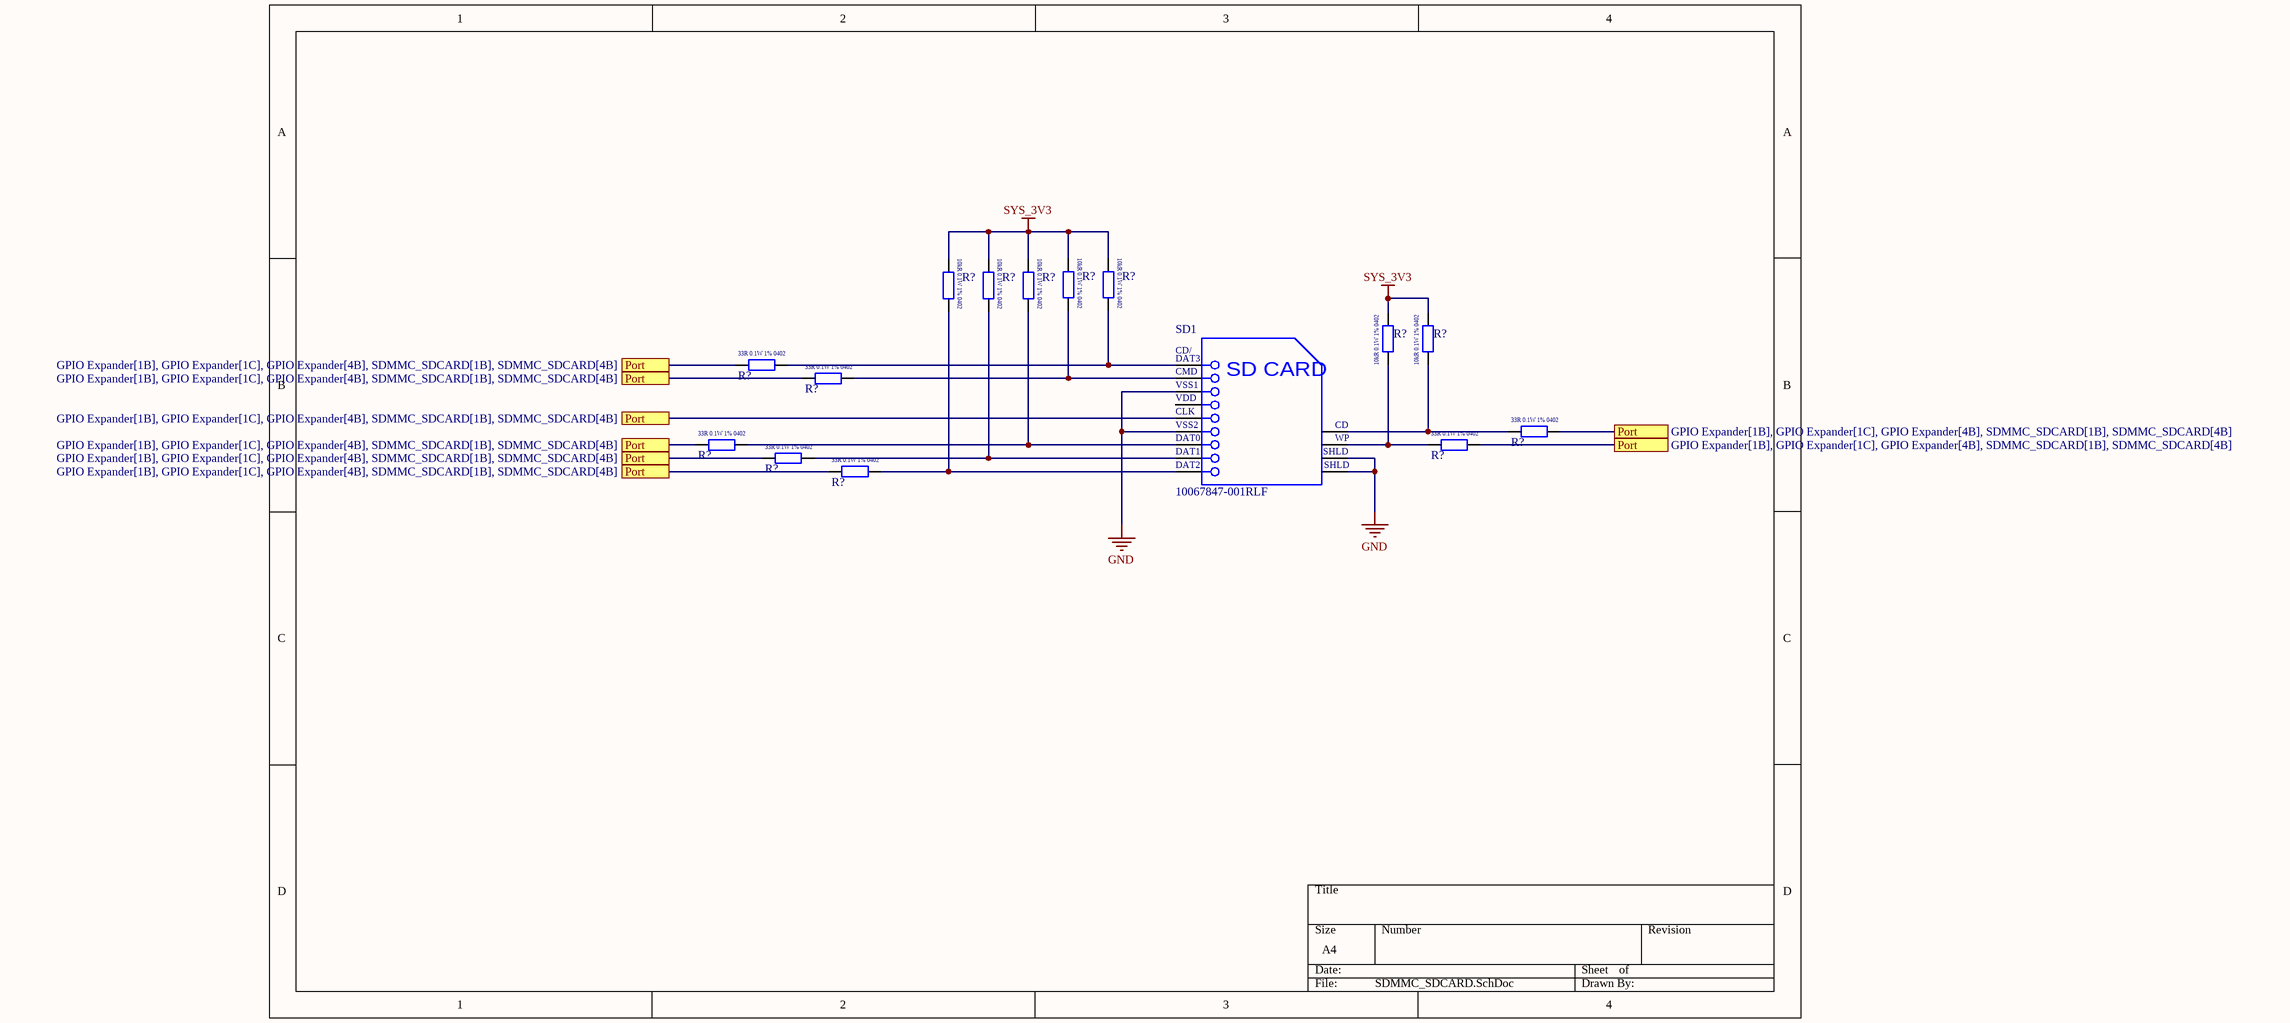
[diagram p13: SDMMC_SDCARD.SchDoc]

### Parts
(Parts that share a designator on the sheet are numbered #1, #2 ... from top to bottom, then left to right.)
R?#124  RK73H1ETTP1002F  [RESC1005X04N]  (value not drawn)
R?#125  RK73H1ETTP1002F  [RESC1005X04N]  (value not drawn)
R?#126  RK73H1ETTP1002F  [RESC1005X04N]  (value not drawn)
R?#127  RK73H1ETTP1002F  [RESC1005X04N]  (value not drawn)
R?#128  RK73H1ETTP1002F  [RESC1005X04N]  (value not drawn)
R?#129  RK73H1ETTP1002F  [RESC1005X04N]  (value not drawn)
R?#130  RK73H1ETTP1002F  [RESC1005X04N]  (value not drawn)
R?#131  ERJ-2RKF33R0X  [RESC1005X04L]  (value not drawn)
R?#132  ERJ-2RKF33R0X  [RESC1005X04L]  (value not drawn)
R?#133  ERJ-2RKF33R0X  [RESC1005X04L]  (value not drawn)
R?#134  ERJ-2RKF33R0X  [RESC1005X04L]  (value not drawn)
R?#135  ERJ-2RKF33R0X  [RESC1005X04L]  (value not drawn)
R?#136  ERJ-2RKF33R0X  [RESC1005X04L]  (value not drawn)
R?#137  ERJ-2RKF33R0X  [RESC1005X04L]  (value not drawn)
SD1  10067847-001RLF  [FCI-10067847-001RLF_V]

### Ports
Port (see GPIO Expander[1B], GPIO Expander[1C], GPIO Expander[4B], SDMMC_SDCARD[1B], SDMMC_SDCARD[4B])

### Nets
GND: SD1.3(VSS1) SD1.6(VSS2) SD1.12(SHLD1) SD1.13(SHLD2)
SYS_3V3: R?#124.1 R?#125.1 R?#126.1 R?#127.1 R?#128.1 R?#129.2 R?#130.2
NetR?#124_2: R?#124.2 R?#137.2 SD1.9(DAT2)
NetR?#125_2: R?#125.2 R?#136.2 SD1.8(DAT1)
NetR?#126_2: R?#126.2 R?#134.2 SD1.7(DAT0)
NetR?#127_2: R?#127.2 R?#132.2 SD1.2(CMD)
NetR?#128_2: R?#128.2 R?#131.2 SD1.1(CD/DAT3)
NetR?#129_1: R?#129.1 R?#135.1 SD1.11(WP)
NetR?#130_1: R?#130.1 R?#133.1 SD1.10(CD)
NetR?#131_1: R?#131.1 R?#132.1 R?#133.2 R?#134.1 R?#135.2 R?#136.1 R?#137.1 SD1.5(CLK) ; port Port

Not connected (* = marked no-connect by the designer): SD1 4(VDD)

### Notes on the sheet
- (in symbol CMP-2000-05818-1) CD/; DAT3; SD CARD; SHLD
- (in symbol ERJ-2RKF33R0X) 33R 0.1W 1% 0402
- (in symbol RK73H1ETTP1002F) 10kR 0.1W 1% 0402

### Library data of the parts
R?#124-R?#130 = RK73H1ETTP1002F: as R?#15 on sheet Ethernet
R?#131-R?#137 = ERJ-2RKF33R0X: as R?#95 on sheet JTAG interfaces
SD1 = CMP-2000-05818-1: Assembly SD Card Reader, Famale, 11 Way, -40 to 105 degC, RoHS, Tape and Reel; Manufacturer: FCI Electronics; SVHC: NoSVHC(15-Jun-2015); Connector Type: MemoryCard; No. of Contacts: 11Contacts; Datasheet Version: Rev. K, 09/2014; Datasheet URL: https://datasheet.ciiva.com/1106/10067847-1106690.pdf; Package Reference: 10067847-001RLF; Product Range: -; Contact Material: CopperAlloy; Contact Plating: GoldPlatedContacts; Package Description: 11-Pin Surface Mount Device, Body 29 x 28.5 mm; Mounting Technology: SurfaceMount; Manufacturer URL: http://portal.fciconnect.com/

## Sheet PCIe.SchDoc
size A4; SheetNumber: 12; SheetTotal: 13
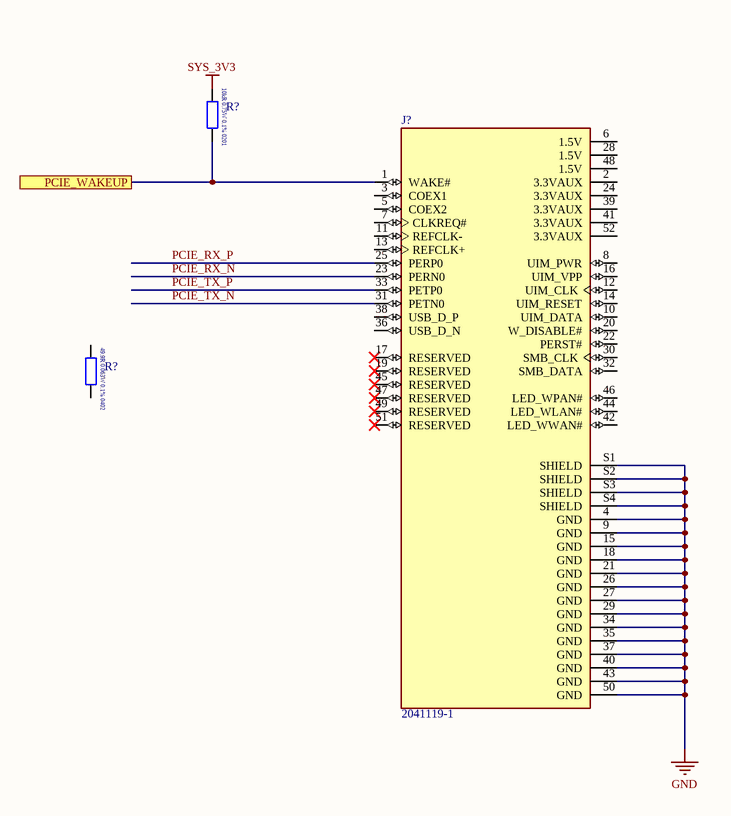
[diagram p14: PCIe.SchDoc]

### Parts
(Parts that share a designator on the sheet are numbered #1, #2 ... from top to bottom, then left to right.)
J?#2  2041119-1
R?#138  TNPW020110K0BEED  [RESC0603X03N]  (value not drawn)
R?#139  ERA-2AEB49R9X  [RESC1005X04L]  (value not drawn)

### Ports
PCIE_WAKEUP

### Nets
GND: J?#2.4(GND) J?#2.9(GND) J?#2.15(GND) J?#2.18(GND) J?#2.21(GND) J?#2.26(GND) J?#2.27(GND) J?#2.29(GND) J?#2.34(GND) J?#2.35(GND) J?#2.37(GND) J?#2.40(GND) J?#2.43(GND) J?#2.50(GND) J?#2.S1(SHIELD) J?#2.S2(SHIELD) J?#2.S3(SHIELD) J?#2.S4(SHIELD)
SYS_3V3: R?#138.1
PCIE_RX_N: J?#2.23(PERN0)
PCIE_RX_P: J?#2.25(PERP0)
PCIE_TX_N: J?#2.31(PETN0)
PCIE_TX_P: J?#2.33(PETP0)
NetJ?#2_1: J?#2.1(WAKE#) R?#138.2 ; port PCIE_WAKEUP

Not connected (* = marked no-connect by the designer): J?#2 2(3.3VAUX) 3(COEX1) 5(COEX2) 6(1.5V) 7(CLKREQ#) 8(UIM_PWR) 10(UIM_DATA) 11(REFCLK-) 12(UIM_CLK) 13(REFCLK+) 14(UIM_RESET) 16(UIM_VPP) 17(RESERVED)* 19(RESERVED)* 20(W_DISABLE#) 22(PERST#) 24(3.3VAUX) 28(1.5V) 30(SMB_CLK) 32(SMB_DATA) 36(USB_D_N) 38(USB_D_P) 39(3.3VAUX) 41(3.3VAUX) 42(LED_WWAN#) 44(LED_WLAN#) 45(RESERVED)* 46(LED_WPAN#) 47(RESERVED)* 48(1.5V) 49(RESERVED)* 51(RESERVED)* 52(3.3VAUX); R?#139 1 2

### Notes on the sheet
- (in symbol ERA-2AEB49R9X) 49.9R 0.063W 0.1% 0402
- (in symbol TNPW020110K0BEED) 10kR 0.75W 0.1% 0201

### Library data of the parts
J?#2 = 2041119-1: mSATA/mini PCI-E 4H Type I G/F; Package: None; Price: None; Availability: Unavailable; MP: 2041119-1; Value: *
R?#138 = TNPW020110K0BEED: as R?#39 on sheet GPIO Expander
R?#139 = ERA-2AEB49R9X: 49.9 Ohms ±0.1% 0.063W, 1/16W Chip Resistor 0402 (1005 Metric) Automotive AEC-Q200 Thin Film

## Sheet Notes.SchDoc
size A4; SheetNumber: 13; SheetTotal: 13
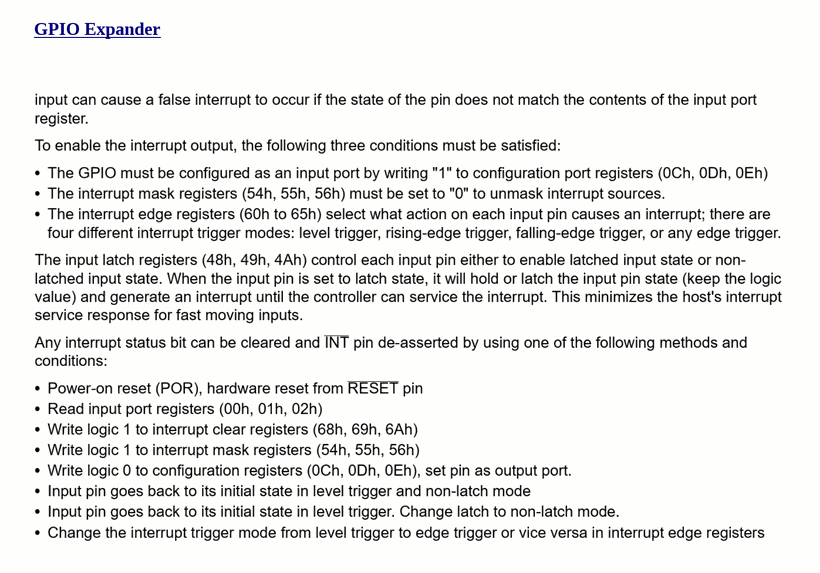
[diagram p15: Notes.SchDoc]

### Notes on the sheet
- GPIO Expander

## Nets that join several sheets
GND: USB Input (10 pins), Boot Switches (R?#11.2 R?#12.2 R?#13.2 R?#14.2), Connector A (19 pins), Ethernet (6 pins), GPIO Expander (5 pins), JTAG interfaces (7 pins), LVDS (61 pins), SDMMC_SDCARD (SD1.3 SD1.6 SD1.12 SD1.13), PCIe (18 pins)
SYS_3V3: Boot Switches (R?#7.1 R?#8.1 R?#9.1 R?#10.1), GPIO Expander (5 pins), JTAG interfaces (13 pins), LVDS (14 pins), SDMMC_SDCARD (7 pins), PCIe (R?#138.1)